# Altium project MSM8916_DRAM_PMIC_REF.PrjPcb (part 3 of 4)

## Sheet 15 PM8916_CHARGING GPIO.SchDoc
size 871 x 576 mm
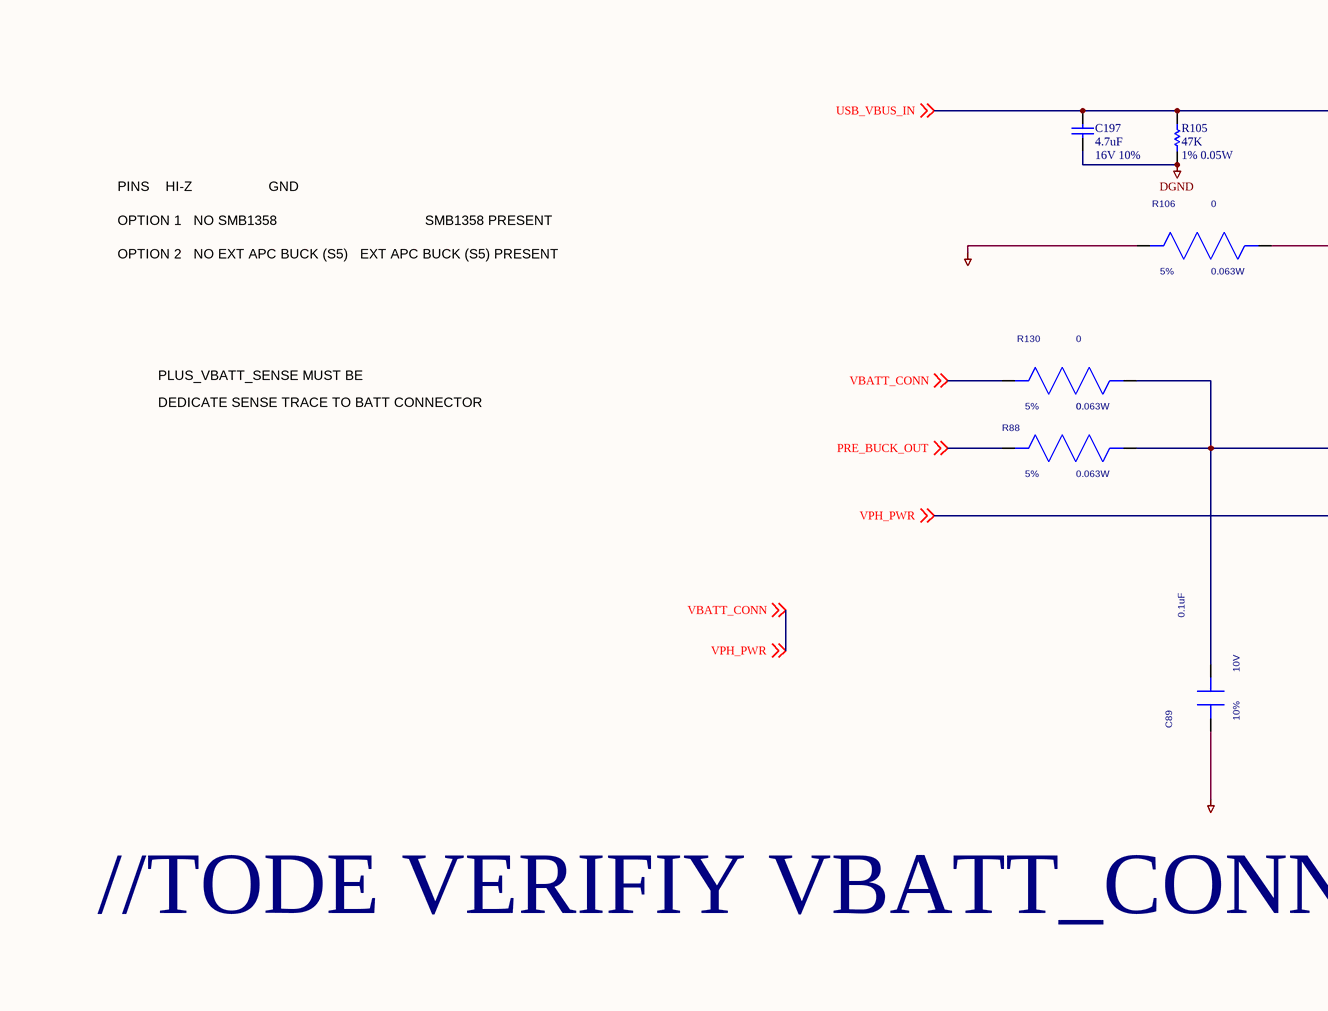
[diagram p39: 15 PM8916_CHARGING GPIO.SchDoc, top left]
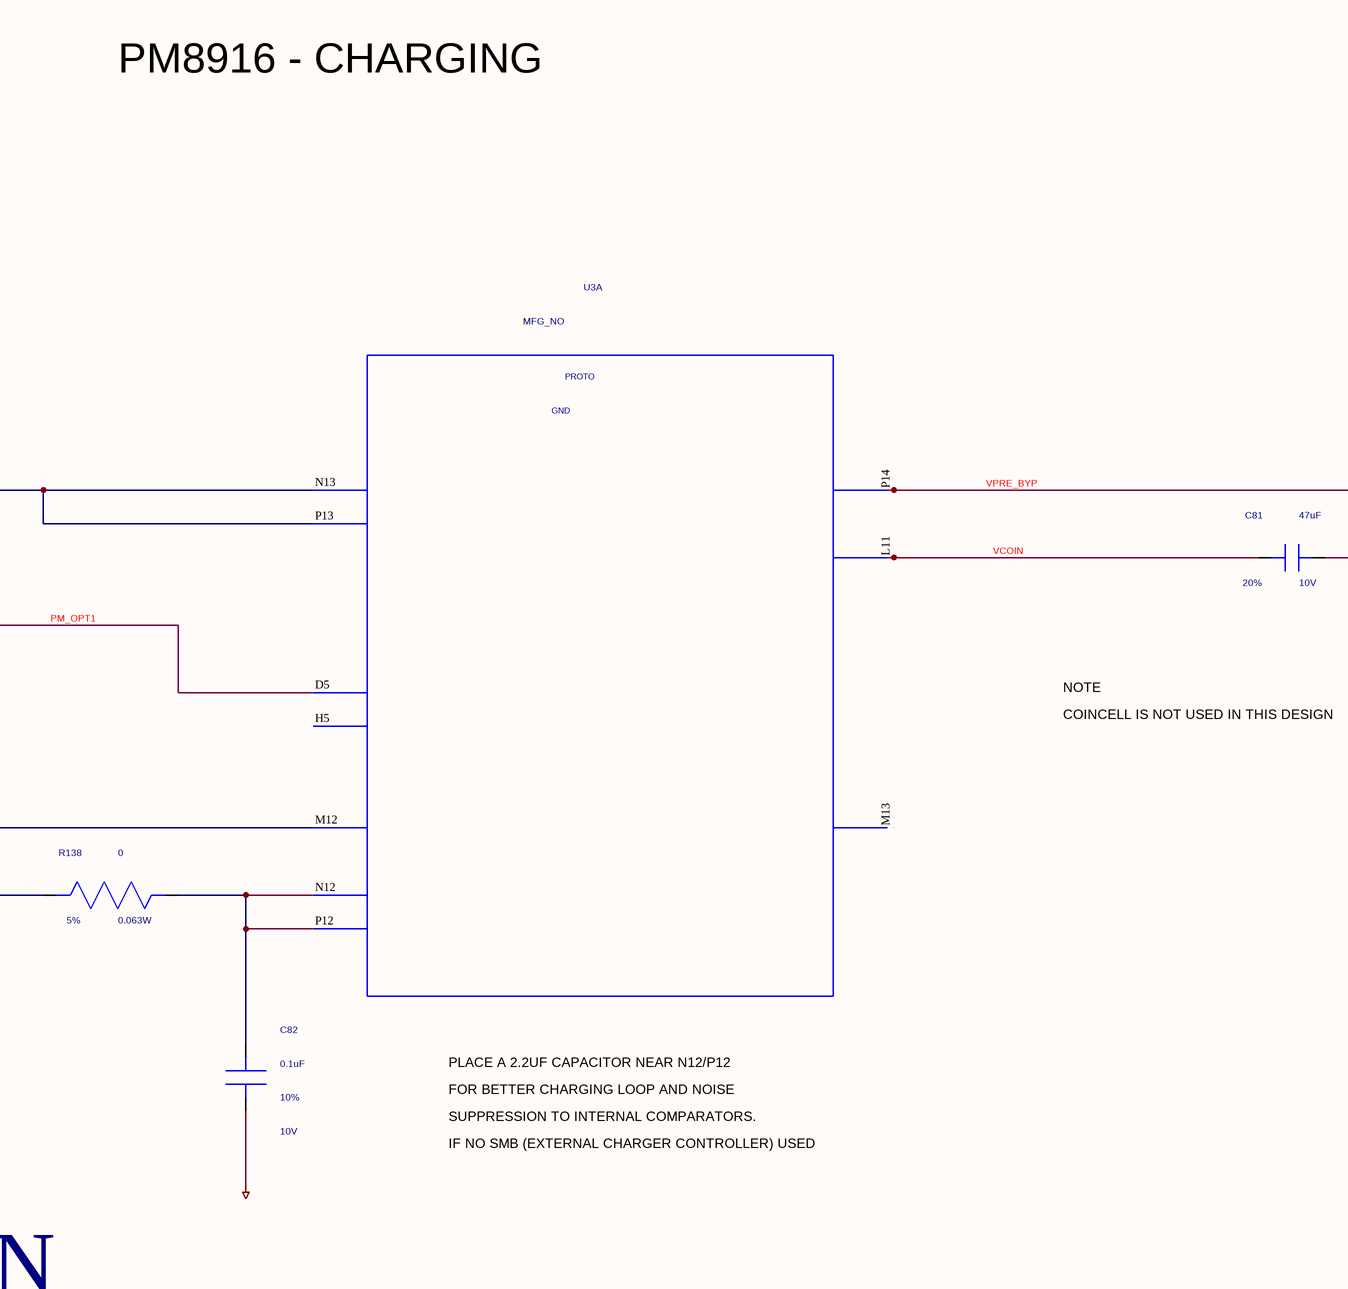
[diagram p40: 15 PM8916_CHARGING GPIO.SchDoc, top middle]
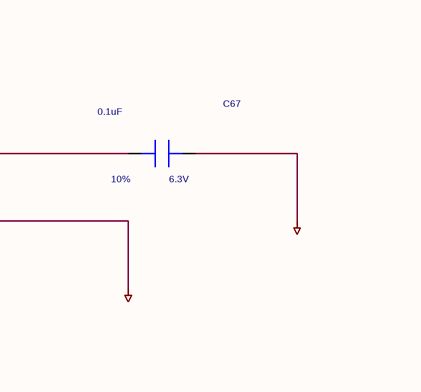
[diagram p41: 15 PM8916_CHARGING GPIO.SchDoc, top right]
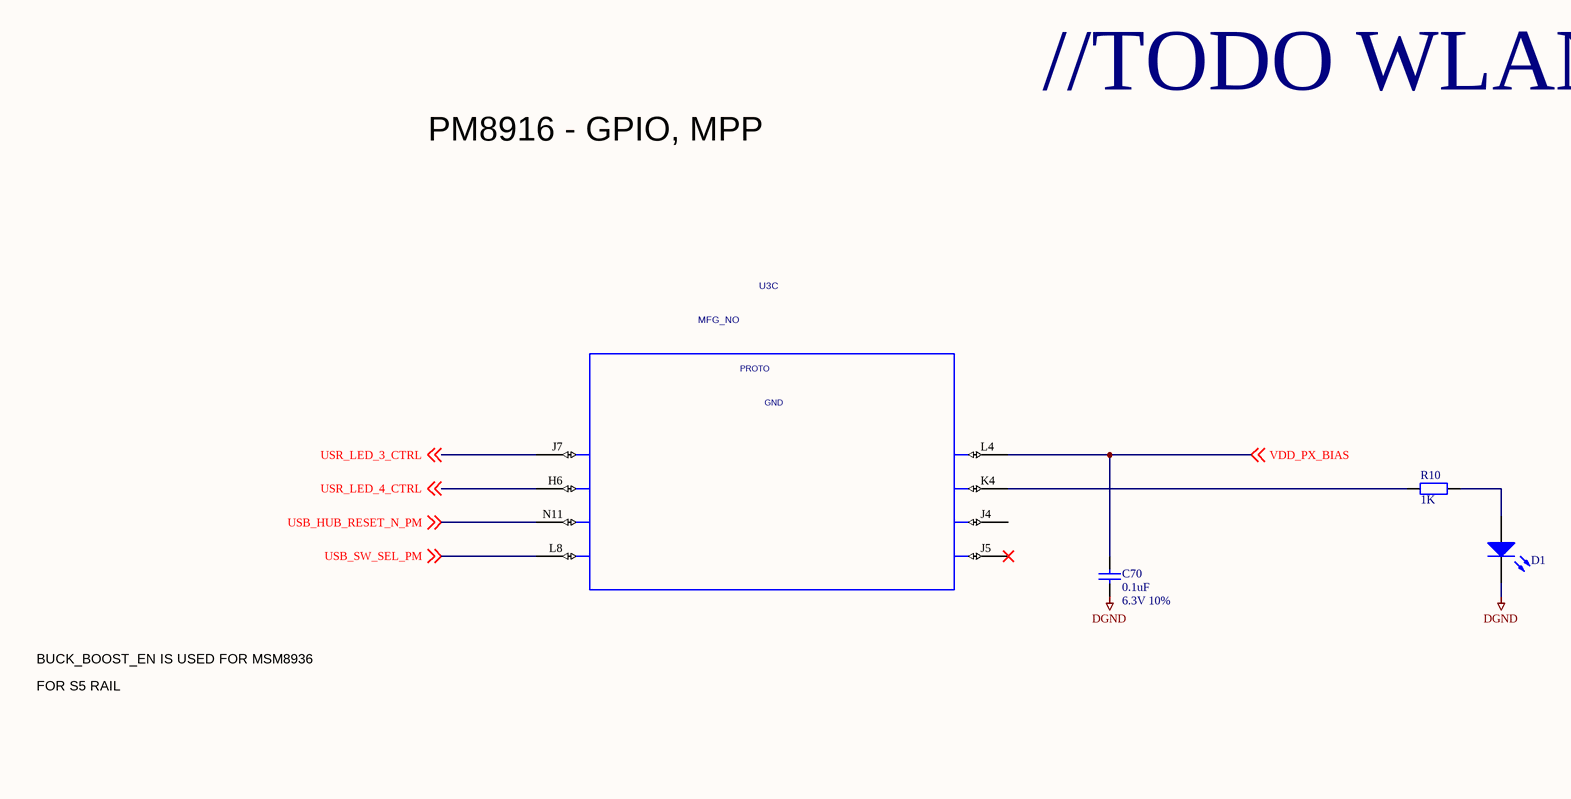
[diagram p42: 15 PM8916_CHARGING GPIO.SchDoc, bottom left]
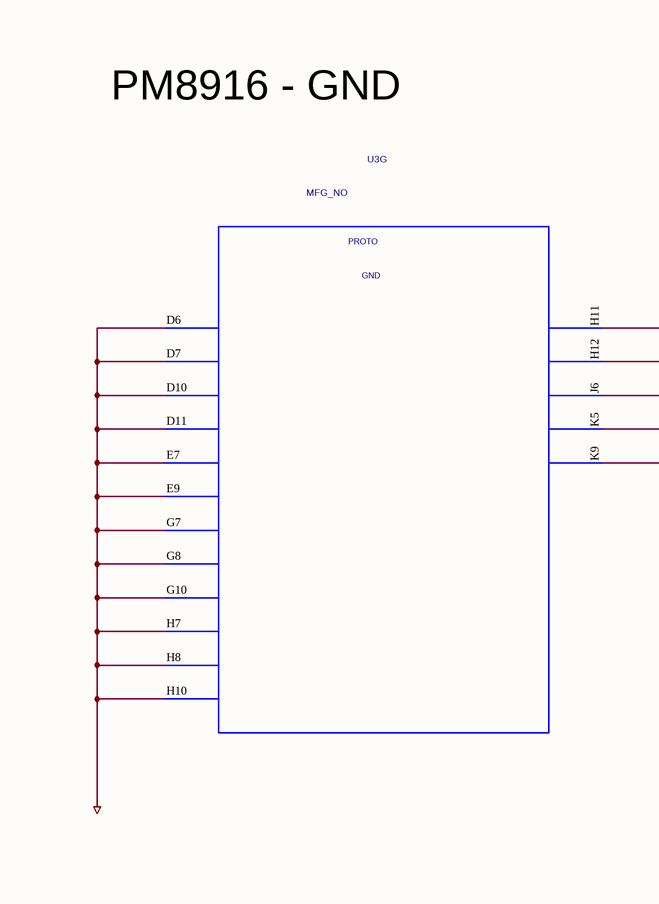
[diagram p43: 15 PM8916_CHARGING GPIO.SchDoc, bottom middle]
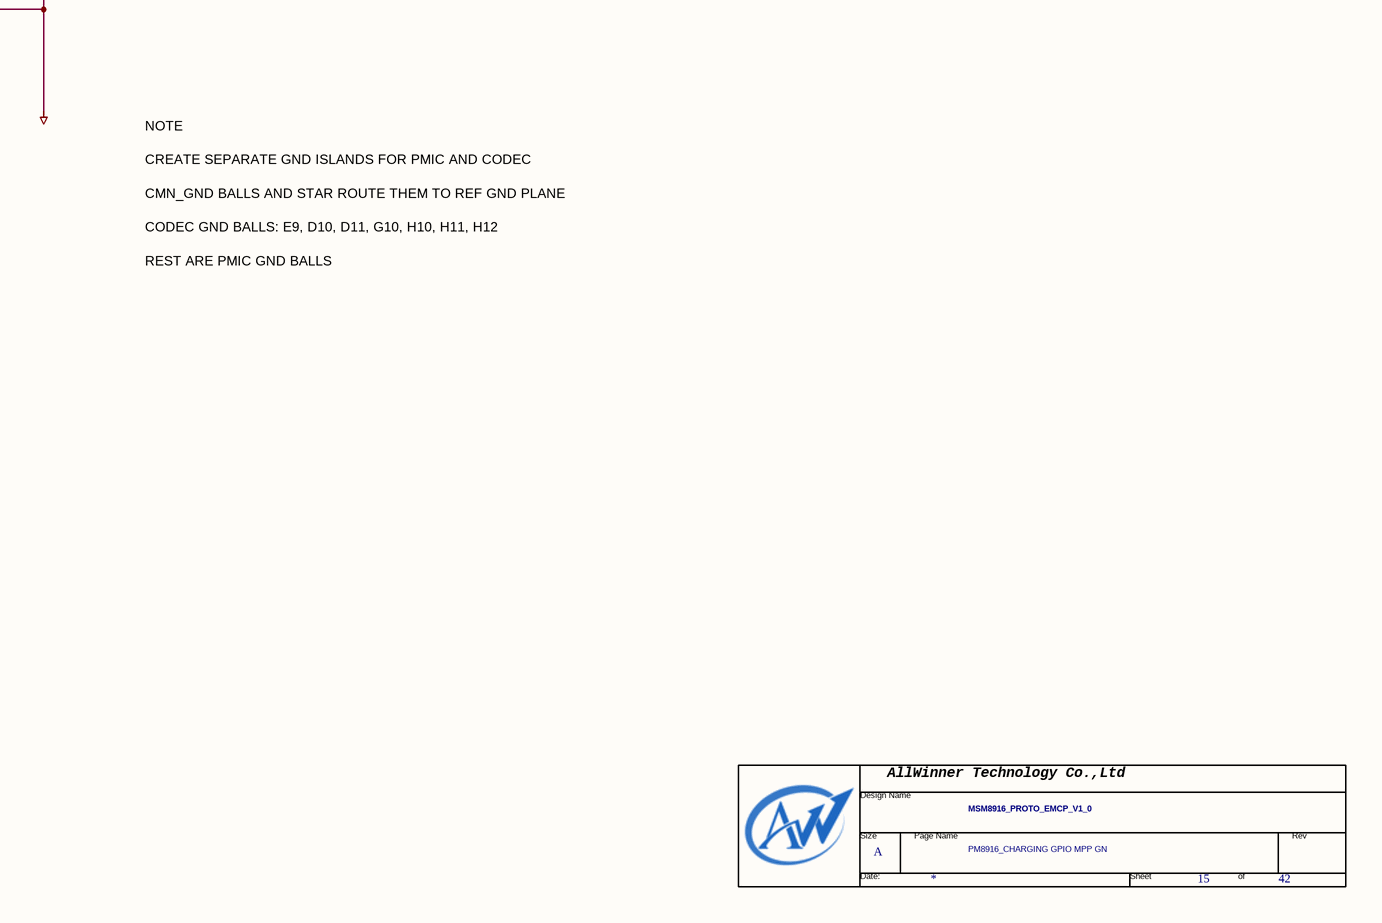
[diagram p44: 15 PM8916_CHARGING GPIO.SchDoc, bottom right]

### Parts
(Parts that share a designator on the sheet are numbered #1, #2 ... from top to bottom, then left to right.)
*#8  Page Count: 42  Page Number: 15  Page Size: A  Title: MSM8916_PROTO_EMCP_V1_0  Doc: PM8916_CHARGING GPIO MPP GN  (hidden comment: TitleBlock0-AW)  (graphical)
C67  0.1uF  VOLT: 10%  Tolerance: 6.3V  [0402C]
C70  0.1uF  value 6.3V 10%  [0402C]
C81  47uF  VOLT: 10V  Tolerance: 20%  [c0402]
C82  0.1uF  VOLT: 10V  Tolerance: 10%  [0402C]
C89  0.1uF  VOLT: 10V  Tolerance: 10%  [0402C]
C197  4.7uF  value 16V 10%  [C0402]
D1  LED0  [LED_0805]  (value not drawn)
R10  value 1K  [r0402]  (hidden comment: Res1)
R88  0  Tolerance: 5%  POWER: 0.063W  [c0402]
R105  47K  value 1% 0.05W  [r0402]
R106  0  Tolerance: 5%  POWER: 0.063W  [c0402]
R130  0  Tolerance: 5%  POWER: 0.063W  [c0402]
R138  0  Tolerance: 5%  POWER: 0.063W  [c0402]
U3  SYMNAME: GND  PART_ID: MFG_NO  BLOCKID: PROTO  [PM-8916-0-176NSP-TR-00-0]  (hidden comment: ASIC_PM8916)  (parts A,C,G of 7)

### Nets
DGND: C67.1(POS) C70.1 C81.2(NEG) C82.2(NEG) C89.1(POS) C197.1 D1.2(K) R105.1 R106.1(POS) U3.D6(CMN_GND_1) U3.D7(CMN_GND_2) U3.D10(CMN_GND_3) U3.D11(CMN_GND_4) U3.E7(CMN_GND_5) U3.E9(CMN_GND_6) U3.G7(CMN_GND_7) U3.G8(CMN_GND_8) U3.G10(CMN_GND_9) U3.H7(CMN_GND_10) U3.H8(CMN_GND_11) U3.H10(CMN_GND_12) U3.H11(CMN_GND_13) U3.H12(CMN_GND_14) U3.J6(CMN_GND_15) U3.K5(CMN_GND_16) U3.K9(CMN_GND_17)
PM_OPT1: R106.2(NEG) U3.D5(OPTION1)
PRE_BUCK_OUT: R88.1(POS) ; off-sheet PRE_BUCK_OUT
USB_HUB_RESET_N_PM: U3.N11(GPIO3) ; off-sheet USB_HUB_RESET_N_PM
USB_SW_SEL_PM: U3.L8(GPIO4) ; off-sheet USB_SW_SEL_PM
USB_VBUS_IN: C197.2 R105.2 U3.N13(USB_IN1) U3.P13(USB_IN2) ; off-sheet USB_VBUS_IN
USR_LED_3_CTRL: U3.J7(GPIO1) ; off-sheet USR_LED_3_CTRL
USR_LED_4_CTRL: U3.H6(GPIO2) ; off-sheet USR_LED_4_CTRL
VBATT_CONN: R130.1(POS) R138.1(POS) ; off-sheet VPH_PWR, off-sheet VBATT_CONN  [also labelled VPH_PWR]
VCOIN: C81.1(POS) U3.L11(VCOIN)
VDD_PX_BIAS: C70.2 U3.L4(MPP1) ; off-sheet VDD_PX_BIAS
VPRE_BYP: C67.2(NEG) U3.P14(VPRE_BYP)
NetC82_1: C82.1(POS) R138.2(NEG) U3.N12(VBAT1) U3.P12(VBAT2)
NetC89_2: C89.2(NEG) R88.2(NEG) R130.2(NEG) U3.M12(VBAT_SNS)
NetD1_1: D1.1(A) R10.2
NetR10_1: R10.1 U3.K4(MPP2)

Not connected (* = marked no-connect by the designer): U3 H5(OPTION2) J4(MPP3) J5(MPP4)* M13(CHG_LED_SINK)

### Notes on the sheet
- PM8916 - CHARGING
- PINS    HI-Z                   GND
- OPTION 1   NO SMB1358                                     SMB1358 PRESENT
- OPTION 2   NO EXT APC BUCK (S5)   EXT APC BUCK (S5) PRESENT
- NOTE
- COINCELL IS NOT USED IN THIS DESIGN
- PLUS_VBATT_SENSE MUST BE
- DEDICATE SENSE TRACE TO BATT CONNECTOR
- PLACE A 2.2UF CAPACITOR NEAR N12/P12
- FOR BETTER CHARGING LOOP AND NOISE
- SUPPRESSION TO INTERNAL COMPARATORS.
- IF NO SMB (EXTERNAL CHARGER CONTROLLER) USED
- //TODE VERIFIY VBATT_CONN
- //TODO WLAN LED HERE
- PM8916 - GND
- PM8916 - GPIO, MPP
- CREATE SEPARATE GND ISLANDS FOR PMIC AND CODEC
- BUCK_BOOST_EN IS USED FOR MSM8936
- CMN_GND BALLS AND STAR ROUTE THEM TO REF GND PLANE
- CODEC GND BALLS: E9, D10, D11, G10, H10, H11, H12
- FOR S5 RAIL
- REST ARE PMIC GND BALLS
- (in symbol TitleBlock0-AW) AllWinner Technology Co.,Ltd; Design Name; Size; Page Name; Rev; Date:; Sheet; of

### Library data of the parts
C67 C81 C89 = CAP#1: PART_NUMBER: MCN_NO; PART_ID: MFG_NO; OriginalSymbolOrigin: (-75,50); SYMNAME: CAP; CDS_LMAN_SYM_OUTLINE: -25,50,25,-50; PACK_TYPE: ?
C70 C197 = Cap: Capacitor; Published: 8-Jun-2000; LatestRevisionDate: 17-Jul-2002; LatestRevisionNote: Re-released for DXP Platform.; PackageReference: RAD-0.3; Publisher: Altium Limited; PackageDescription: Radial Cap, Thru-Hole; 2 Leads; 0.3 in Pin Spacing
C82 = CAP: PART_NUMBER: MCN_NO; PART_ID: MFG_NO; OriginalSymbolOrigin: (-100,75); CDS_LMAN_SYM_OUTLINE: -75,25,75,-25; SYMNAME: CAP; PACK_TYPE: ?
D1 = LED0: 发光二极管; Published: 8-Jun-2000; LatestRevisionDate: 08-Jul-2005; LatestRevisionNote: Mech Layer 1 removed.; PackageReference: LED-0; Publisher: Altium Limited
R10 = Res1: 贴片电阻; Published: 8-Jun-2000; LatestRevisionDate: 17-Jul-2002; LatestRevisionNote: Re-released for DXP Platform.; PackageReference: AXIAL-0.4; Publisher: Altium Limited
R88 R106 R130 R138 = RESISTOR_Dup3: PART_NUMBER: MCN_NO; PART_ID: MFG_NO; OriginalSymbolOrigin: (-200,50); CDS_LMAN_SYM_OUTLINE: -150,50,150,-50; SYMNAME: resistor; PACK_TYPE: ?
R105 = Res1: Resistor; Published: 8-Jun-2000; LatestRevisionDate: 17-Jul-2002; LatestRevisionNote: Re-released for DXP Platform.; PackageReference: AXIAL-0.3; Publisher: Altium Limited; PackageDescription: Axial Device, Thru-Hole; 2 Leads; 0.3 in Pin Spacing
U3 = ASIC_PM8916: PART_NUMBER: MCN_NO; OriginalSymbolOrigin: (-1050,1125); SPLIT_INST: TRUE; CDS_LMAN_SYM_OUTLINE: -850,1125,875,-1250; CDS_LMAN_SPLIT_NUMBER: 1 of 7; PACK_TYPE: ?
*#8 = TitleBlock0-AW: RevCode: ?; Page Create Date: March  8, 1995; Page Modify Date: *

## Sheet 16 PM8916_SMPS.SchDoc
size 868 x 576 mm
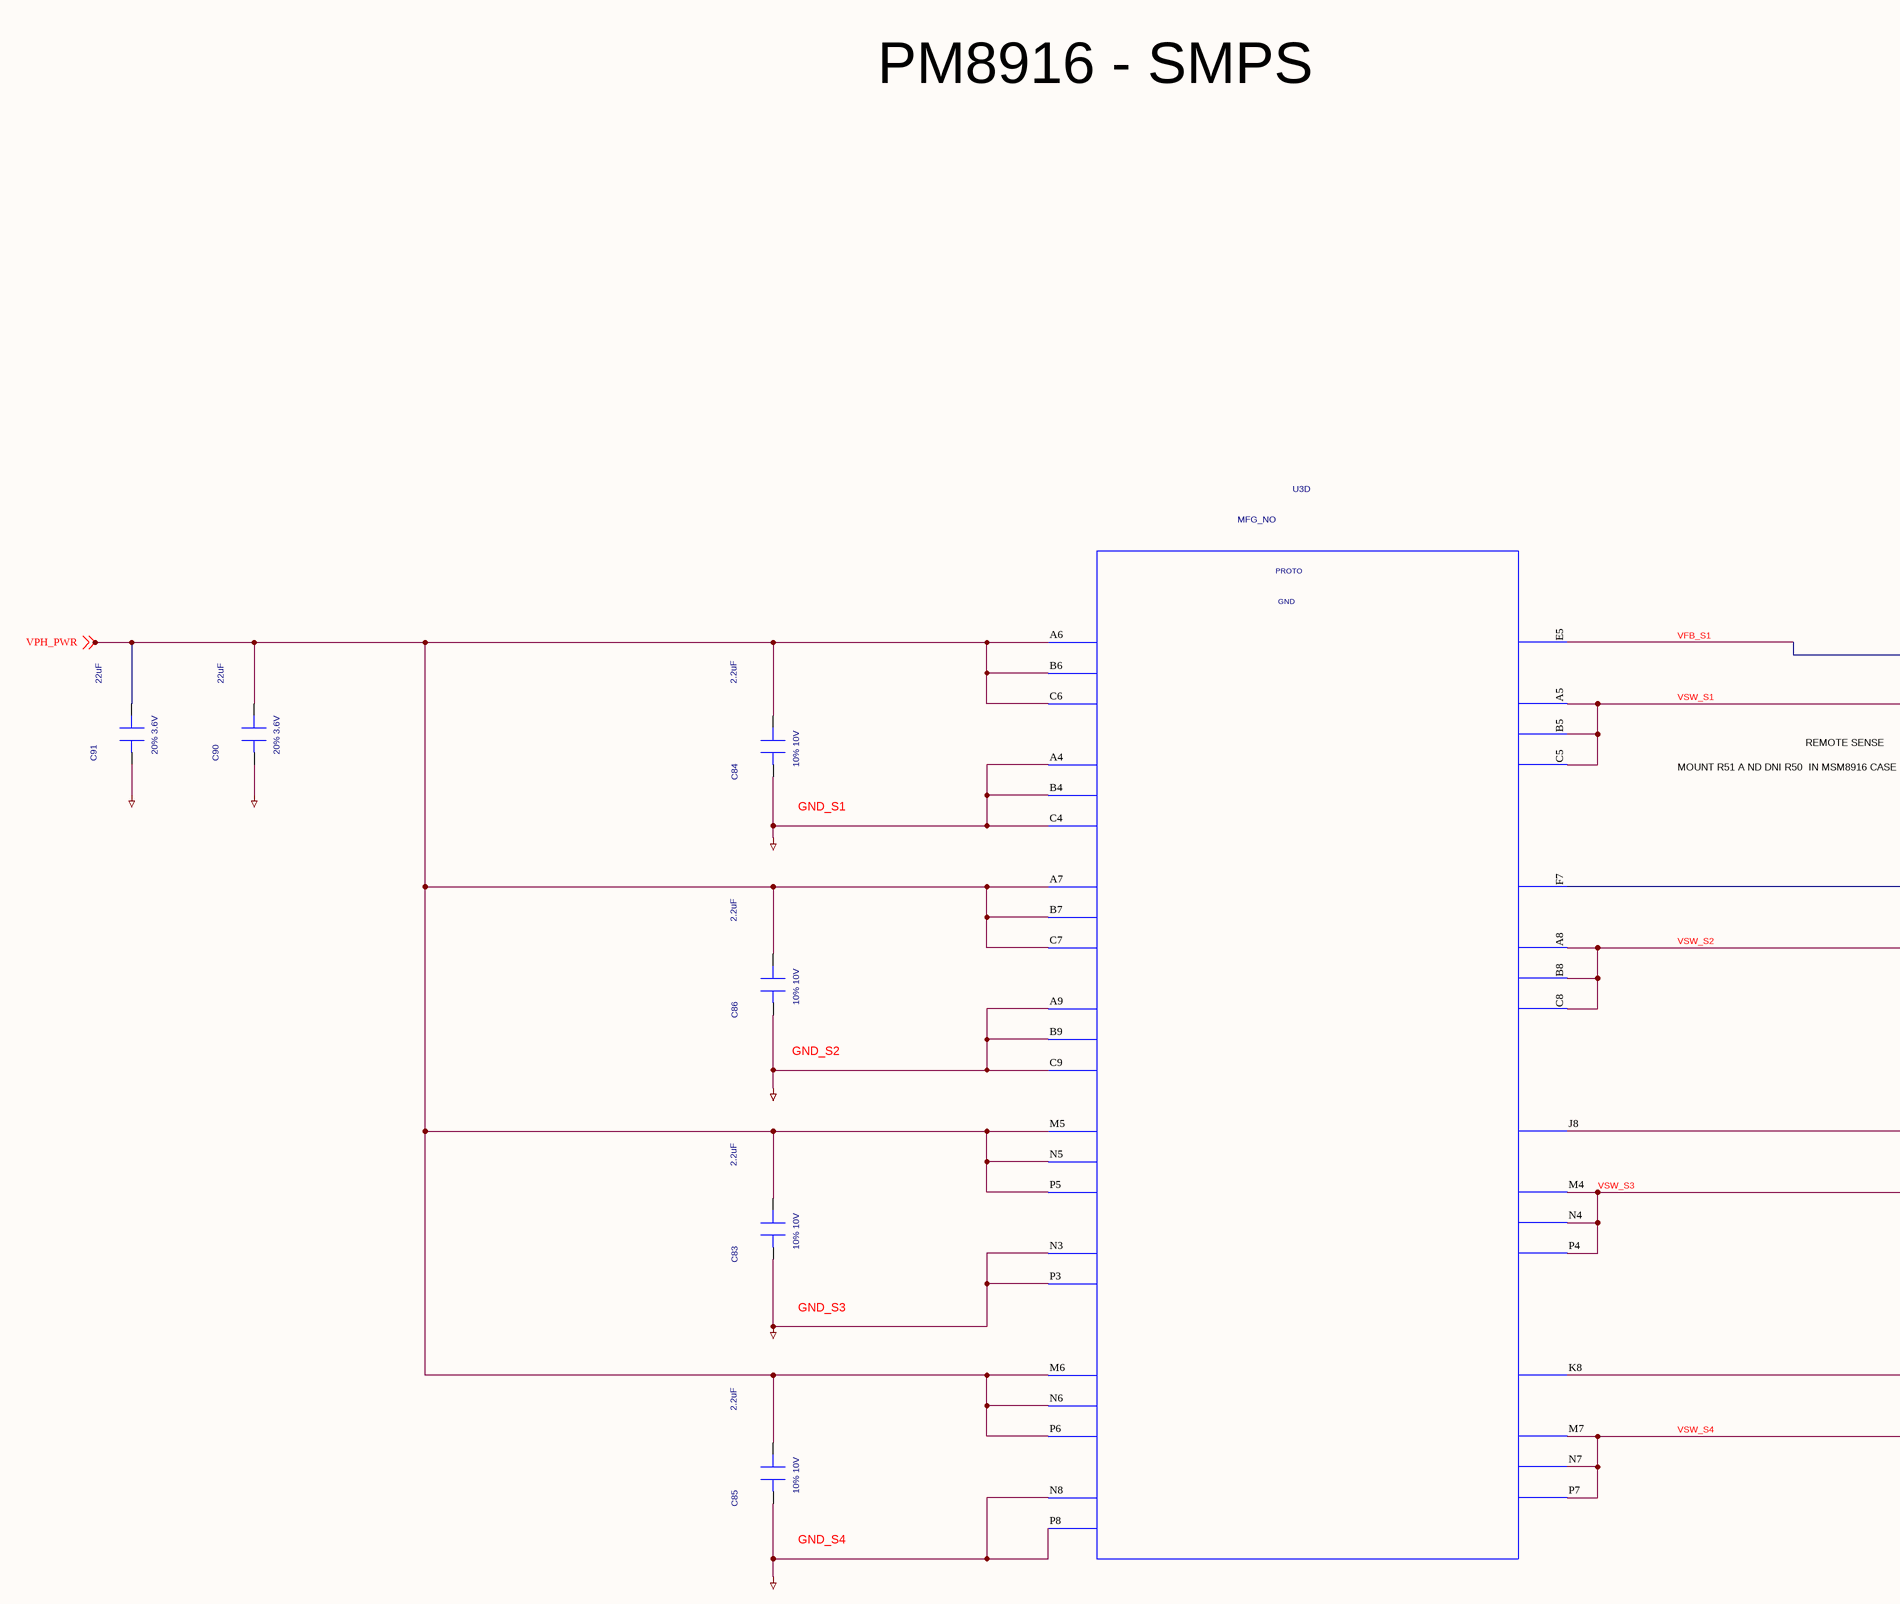
[diagram p45: 16 PM8916_SMPS.SchDoc, top left]
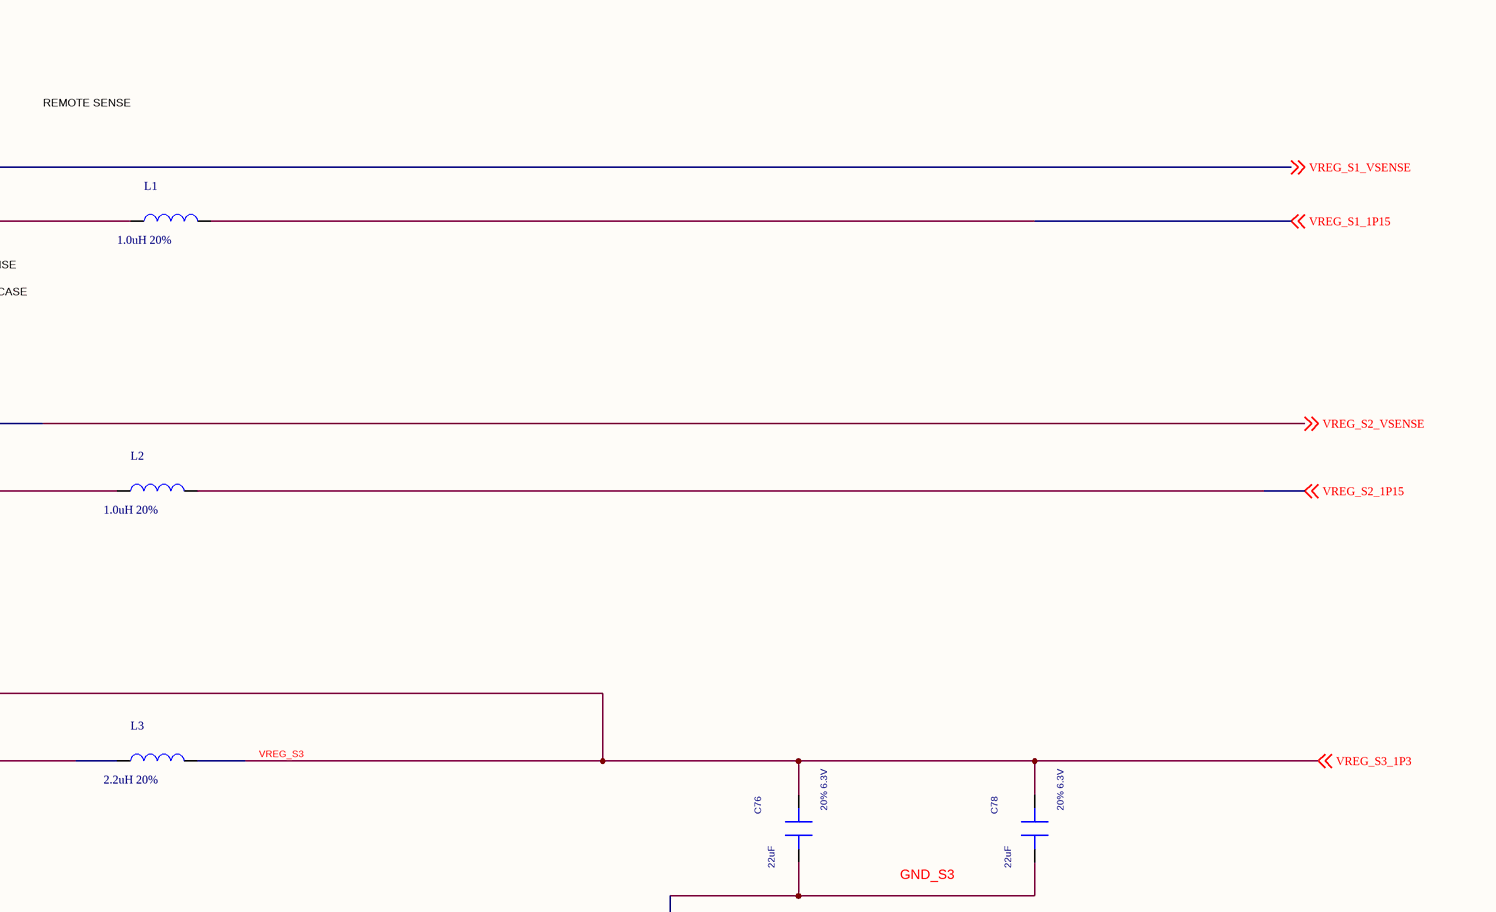
[diagram p46: 16 PM8916_SMPS.SchDoc, top right]
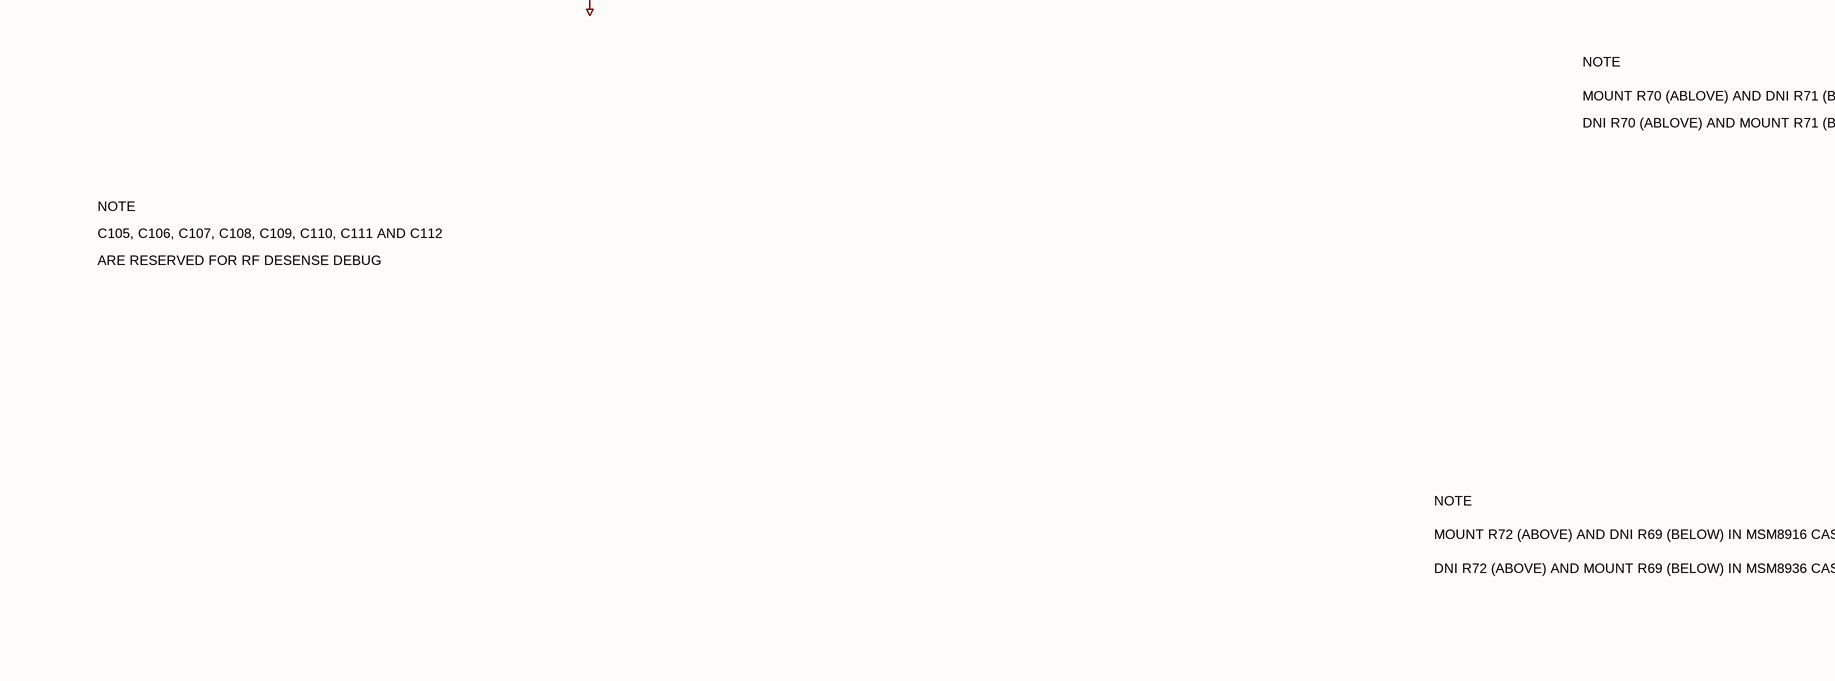
[diagram p47: 16 PM8916_SMPS.SchDoc, bottom left]
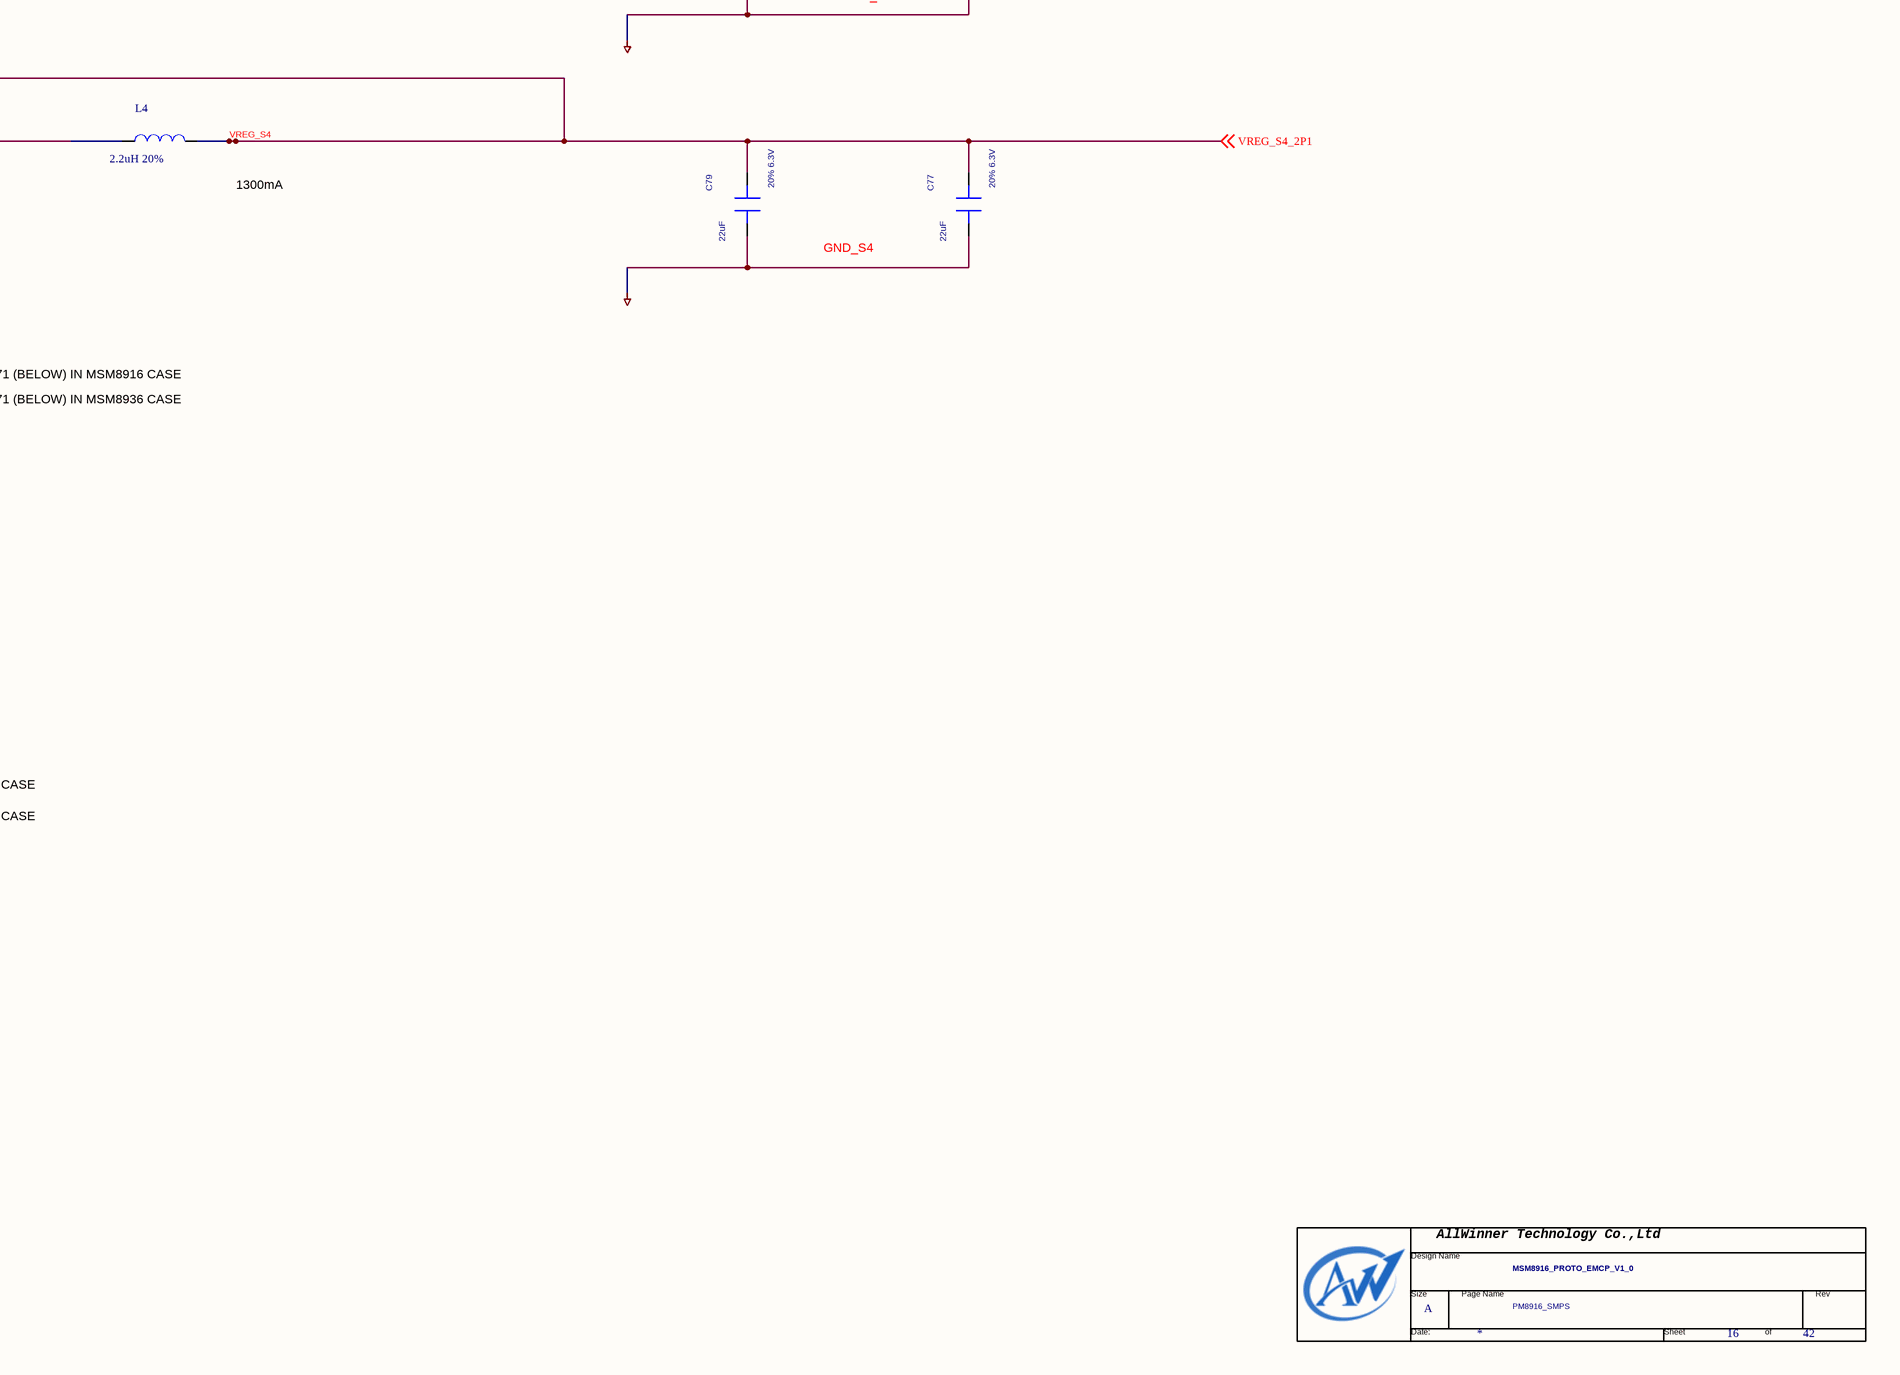
[diagram p48: 16 PM8916_SMPS.SchDoc, bottom right]

### Parts
(Parts that share a designator on the sheet are numbered #1, #2 ... from top to bottom, then left to right.)
*#9  Page Count: 42  Page Number: 16  Page Size: A  Title: MSM8916_PROTO_EMCP_V1_0  Doc: PM8916_SMPS  (hidden comment: TitleBlock0-AW)  (graphical)
C76  22uF  Tolerance: 20% 6.3V  [c0402]
C77  22uF  Tolerance: 20% 6.3V  [c0402]
C78  22uF  Tolerance: 20% 6.3V  [c0402]
C79  22uF  Tolerance: 20% 6.3V  [c0402]
C83  2.2uF  Tolerance: 10% 10V  [c0402]
C84  2.2uF  Tolerance: 10% 10V  [c0402]
C85  2.2uF  Tolerance: 10% 10V  [c0402]
C86  2.2uF  Tolerance: 10% 10V  [c0402]
C90  22uF  Tolerance: 20% 3.6V  [c0402]
C91  22uF  Tolerance: 20% 3.6V  [c0402]
L1  1.0uH 20%  [c0402]
L2  1.0uH 20%  [c0402]
L3  2.2uH 20%  [c0402]
L4  2.2uH 20%  [c0402]
U3  SYMNAME: GND  PART_ID: MFG_NO  BLOCKID: PROTO  [PM-8916-0-176NSP-TR-00-0]  (hidden comment: ASIC_PM8916)  (part D of 7)

### Nets
DGND: C76.1(POS) C77.1(POS) C78.1(POS) C79.1(POS) C83.1(POS) C84.1(POS) C85.1(POS) C86.1(POS) C90.1(POS) C91.1(POS) U3.A4(GND_S1_1) U3.A9(GND_S2_1) U3.B4(GND_S1_2) U3.B9(GND_S2_2) U3.C4(GND_S1_3) U3.C9(GND_S2_3) U3.N3(GND_S3_1) U3.N8(GND_S4_1) U3.P3(GND_S3_2) U3.P8(GND_S4_2)
VFB_S1: U3.E5(VFB_S1) ; off-sheet VREG_S1_VSENSE  [also labelled VREG_S1_VSENSE]
VPH_PWR: C83.2(NEG) C84.2(NEG) C85.2(NEG) C86.2(NEG) C90.2(NEG) C91.2(NEG) U3.A6(VIN_S1_1) U3.A7(VIN_S2_1) U3.B6(VIN_S1_2) U3.B7(VIN_S2_2) U3.C6(VIN_S1_3) U3.C7(VIN_S2_3) U3.M5(VIN_S3_1) U3.M6(VIN_S4_1) U3.N5(VIN_S3_2) U3.N6(VIN_S4_2) U3.P5(VIN_S3_3) U3.P6(VIN_S4_3) ; off-sheet VPH_PWR  [project net VBATT_CONN]
VREG_S1_1P15: L1.2 ; off-sheet VREG_S1_1P15
VREG_S2_1P15: L2.2 ; off-sheet VREG_S2_1P15
VREG_S2_VSENSE: U3.F7(VFB_S2) ; off-sheet VREG_S2_VSENSE
VREG_S3: C76.2(NEG) C78.2(NEG) L3.2 U3.J8(VFB_S3) ; off-sheet VREG_S3_1P3  [also labelled VREG_S3_1P3]
VREG_S4: C77.2(NEG) C79.2(NEG) L4.2 U3.K8(VFB_S4) ; off-sheet VREG_S4_2P1  [also labelled VREG_S4_2P1]
VSW_S1: L1.1 U3.A5(VSW_S1_1) U3.B5(VSW_S1_2) U3.C5(VSW_S1_3)
VSW_S2: L2.1 U3.A8(VSW_S2_1) U3.B8(VSW_S2_2) U3.C8(VSW_S2_3)
VSW_S3: L3.1 U3.M4(VSW_S3_1) U3.N4(VSW_S3_2) U3.P4(VSW_S3_3)
VSW_S4: L4.1 U3.M7(VSW_S4_1) U3.N7(VSW_S4_2) U3.P7(VSW_S4_3)

### Notes on the sheet
- PM8916 - SMPS
- REMOTE SENSE
- MOUNT R51 A ND DNI R50  IN MSM8916 CASE
- (near C84) GND_S1
- (near C86) GND_S2
- GND_S3
- 1300mA
- GND_S4
- NOTE
- DNI R70 (ABLOVE) AND MOUNT R71 (BELOW) IN MSM8936 CASE
- MOUNT R70 (ABLOVE) AND DNI R71 (BELOW) IN MSM8916 CASE
- ARE RESERVED FOR RF DESENSE DEBUG
- C105, C106, C107, C108, C109, C110, C111 AND C112
- MOUNT R72 (ABOVE) AND DNI R69 (BELOW) IN MSM8916 CASE
- DNI R72 (ABOVE) AND MOUNT R69 (BELOW) IN MSM8936 CASE
- (in symbol TitleBlock0-AW) AllWinner Technology Co.,Ltd; Design Name; Size; Page Name; Rev; Date:; Sheet; of

### Library data of the parts
C76-C79 C83-C86 C90 C91 = CAP#1: PART_NUMBER: MCN_NO; PART_ID: MFG_NO; OriginalSymbolOrigin: (-75,50); VOLT: ?V; SYMNAME: CAP; CDS_LMAN_SYM_OUTLINE: -25,50,25,-50; PACK_TYPE: ?
L1-L4 = INDUCTOR_0
U3 = ASIC_PM8916: as U3 on sheet 15 PM8916_CHARGING GPIO; PACK_TYPE: ?
*#9 = TitleBlock0-AW: RevCode: ?; Page Create Date: March  8, 1995; Page Modify Date: *

## Sheet 17 PM8916_LDO.SchDoc
size 868 x 579 mm
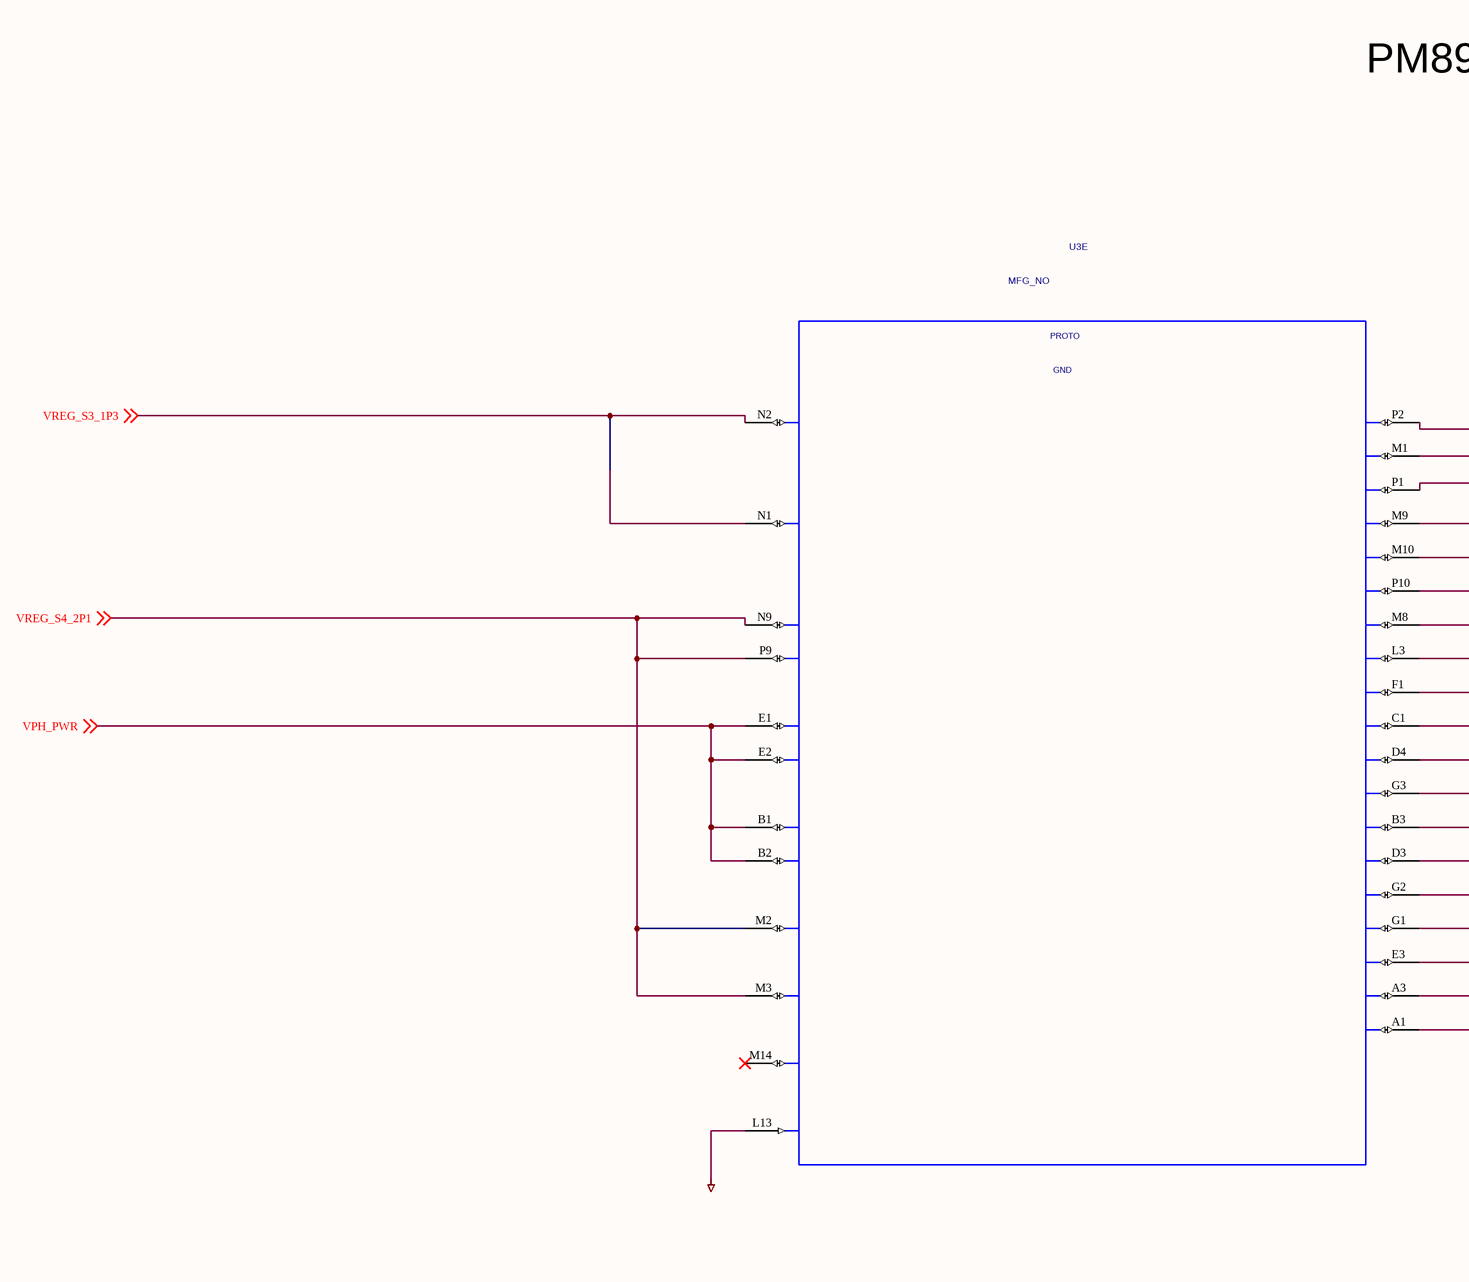
[diagram p49: 17 PM8916_LDO.SchDoc, top left]
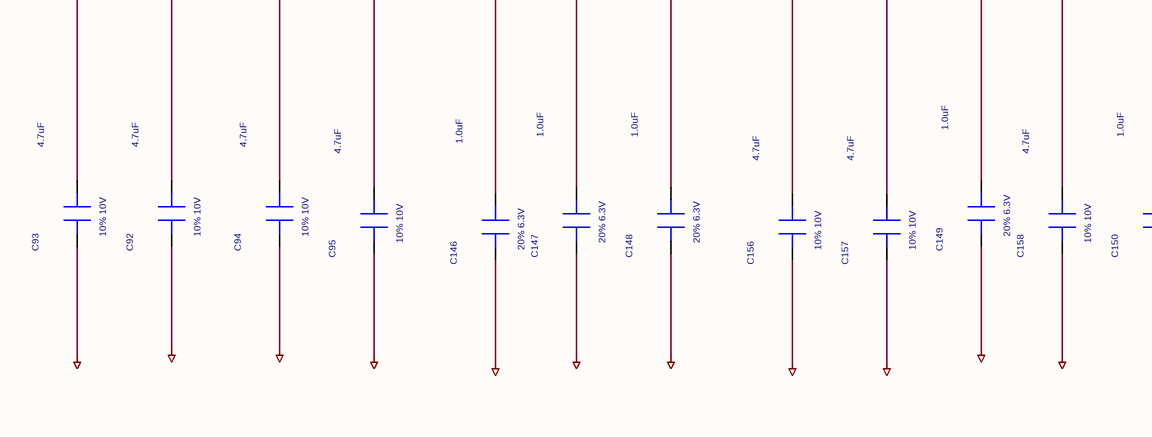
[diagram p50: 17 PM8916_LDO.SchDoc, top middle]
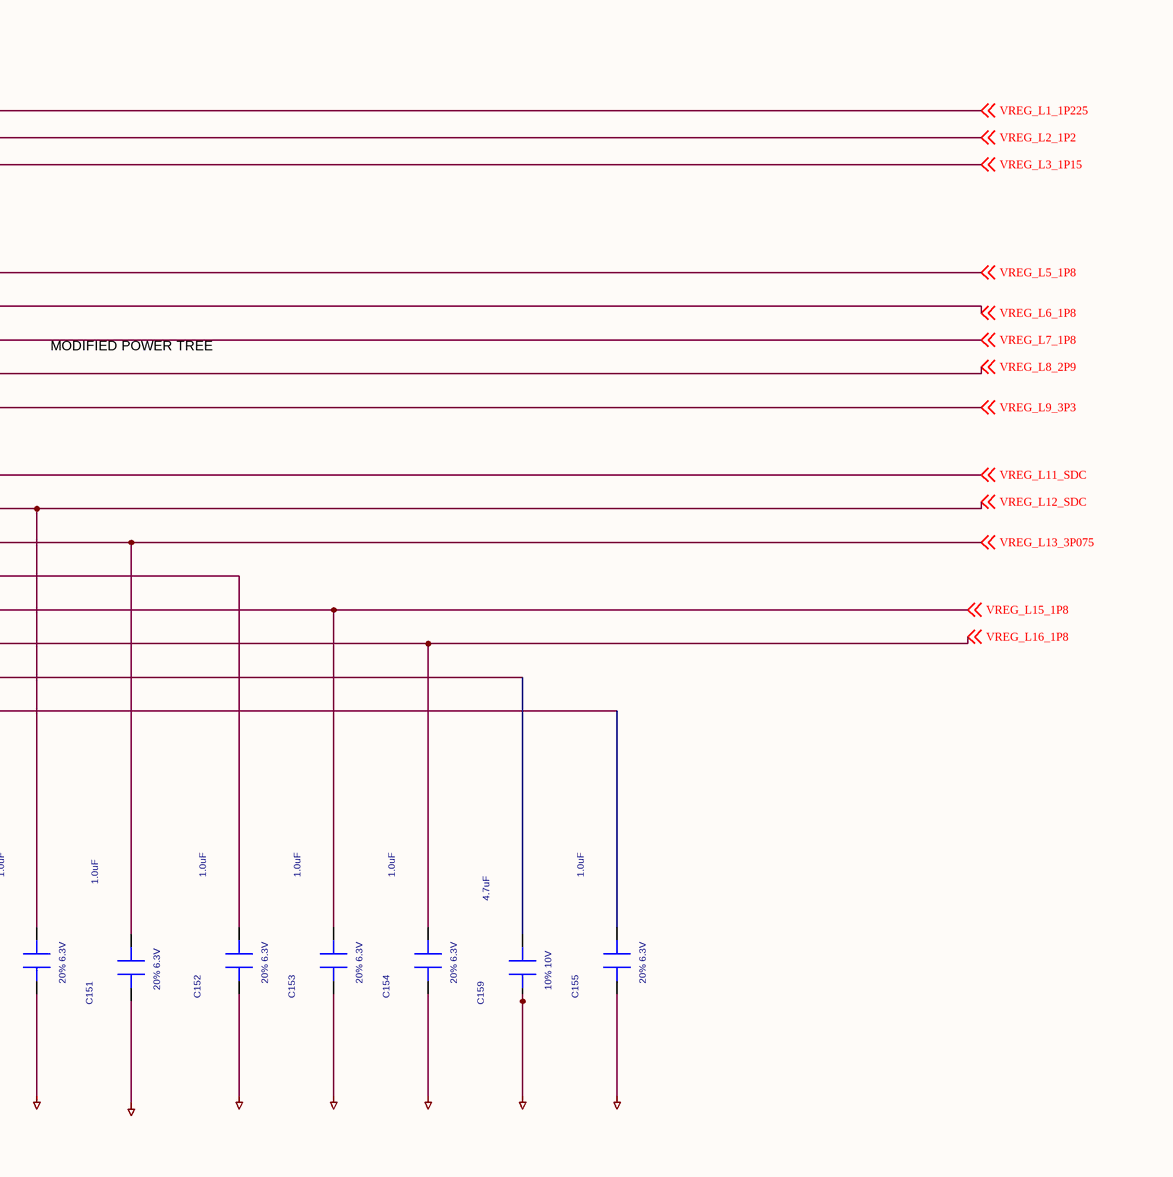
[diagram p51: 17 PM8916_LDO.SchDoc, top right]
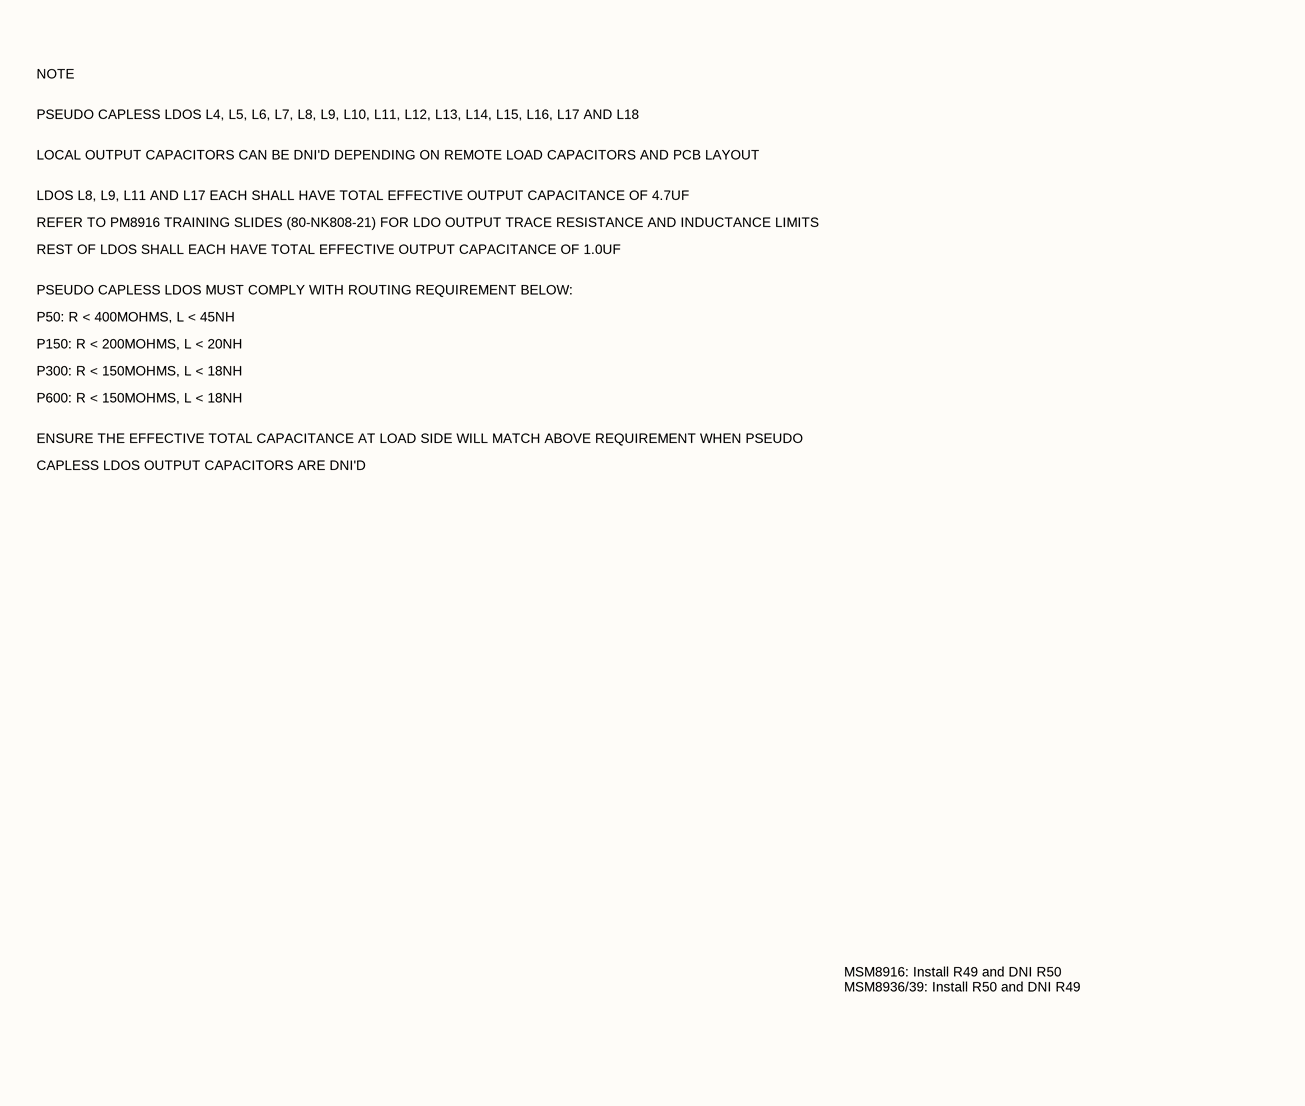
[diagram p52: 17 PM8916_LDO.SchDoc, bottom left]
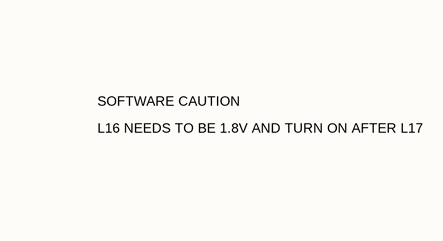
[diagram p53: 17 PM8916_LDO.SchDoc, bottom middle]
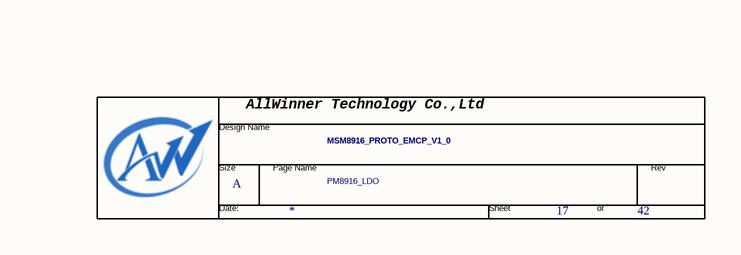
[diagram p54: 17 PM8916_LDO.SchDoc, bottom right]

### Parts
(Parts that share a designator on the sheet are numbered #1, #2 ... from top to bottom, then left to right.)
*#10  Page Count: 42  Page Number: 17  Page Size: A  Title: MSM8916_PROTO_EMCP_V1_0  Doc: PM8916_LDO  (hidden comment: TitleBlock0-AW)  (graphical)
C92  4.7uF  Tolerance: 10% 10V  [c0402]
C93  4.7uF  Tolerance: 10% 10V  [c0402]
C94  4.7uF  Tolerance: 10% 10V  [c0402]
C95  4.7uF  Tolerance: 10% 10V  [c0402]
C146  1.0uF  Tolerance: 20% 6.3V  [c0402]
C147  1.0uF  Tolerance: 20% 6.3V  [c0402]
C148  1.0uF  Tolerance: 20% 6.3V  [c0402]
C149  1.0uF  Tolerance: 20% 6.3V  [c0402]
C150  1.0uF  Tolerance: 20% 6.3V  [c0402]
C151  1.0uF  Tolerance: 20% 6.3V  [c0402]
C152  1.0uF  Tolerance: 20% 6.3V  [c0402]
C153  1.0uF  Tolerance: 20% 6.3V  [c0402]
C154  1.0uF  Tolerance: 20% 6.3V  [c0402]
C155  1.0uF  Tolerance: 20% 6.3V  [c0402]
C156  4.7uF  Tolerance: 10% 10V  [c0402]
C157  4.7uF  Tolerance: 10% 10V  [c0402]
C158  4.7uF  Tolerance: 10% 10V  [c0402]
C159  4.7uF  Tolerance: 10% 10V  [c0402]
U3  SYMNAME: GND  PART_ID: MFG_NO  BLOCKID: PROTO  [PM-8916-0-176NSP-TR-00-0]  (hidden comment: ASIC_PM8916)  (part E of 7)

### Nets
DGND: C92.1(POS) C93.1(POS) C94.1(POS) C95.1(POS) C146.1(POS) C147.1(POS) C148.1(POS) C149.1(POS) C150.1(POS) C151.1(POS) C152.1(POS) C153.1(POS) C154.1(POS) C155.1(POS) C156.1(POS) C157.1(POS) C158.1(POS) C159.1(POS) U3.L13(GND_DRV)
VREG_L2_1P2: C92.2(NEG) U3.M1(VREG_L2) ; off-sheet VREG_L2_1P2
VREG_L5_1P8: C146.2(NEG) U3.P10(VREG_L5) ; off-sheet VREG_L5_1P8
VREG_L6_1P8: C147.2(NEG) U3.M8(VREG_L6) ; off-sheet VREG_L6_1P8
VPH_PWR: U3.B1(VIN_GR5_A) U3.B2(VIN_GR5_B) U3.E1(VIN_GR4_A) U3.E2(VIN_GR4_B) ; off-sheet VPH_PWR  [project net VBATT_CONN]
VREG_L1_1P225: C93.2(NEG) U3.P2(VREG_L1) ; off-sheet VREG_L1_1P225
VREG_L3_1P15: C94.2(NEG) U3.P1(VREG_L3) ; off-sheet VREG_L3_1P15
VREG_L7_1P8: C148.2(NEG) U3.L3(VREG_L7) ; off-sheet VREG_L7_1P8
VREG_L8_2P9: C156.2(NEG) U3.F1(VREG_L8) ; off-sheet VREG_L8_2P9
VREG_L9_3P3: C157.2(NEG) U3.C1(VREG_L9) ; off-sheet VREG_L9_3P3
VREG_L11_SDC: C158.2(NEG) U3.G3(VREG_L11) ; off-sheet VREG_L11_SDC
VREG_L12_SDC: C150.2(NEG) U3.B3(VREG_L12) ; off-sheet VREG_L12_SDC
VREG_L13_3P075: C151.2(NEG) U3.D3(VREG_L13) ; off-sheet VREG_L13_3P075
VREG_L15_1P8: C153.2(NEG) U3.G1(VREG_L15) ; off-sheet VREG_L15_1P8
VREG_L16_1P8: C154.2(NEG) U3.E3(VREG_L16) ; off-sheet VREG_L16_1P8
VREG_S3_1P3: U3.N1(VIN_GR2) U3.N2(VIN_GR1) ; off-sheet VREG_S3_1P3  [project net VREG_S3]
VREG_S4_2P1: U3.M2(VIN_GR6) U3.M3(VIN_GR7) U3.N9(VIN_GR3_A) U3.P9(VIN_GR3_B) ; off-sheet VREG_S4_2P1  [project net VREG_S4]
NetC95_2: C95.2(NEG) U3.M9(VREG_L4_1) U3.M10(VREG_L4_2)
NetC149_2: C149.2(NEG) U3.D4(VREG_L10)
NetC152_2: C152.2(NEG) U3.G2(VREG_L14)
NetC155_2: C155.2(NEG) U3.A1(VREG_L18)
NetC159_2: C159.2(NEG) U3.A3(VREG_L17)

Not connected (* = marked no-connect by the designer): U3 M14(VIB_DRV*)*

### Notes on the sheet
- PM8916 - LDO
- MODIFIED POWER TREE
- NOTE
- PSEUDO CAPLESS LDOS L4, L5, L6, L7, L8, L9, L10, L11, L12, L13, L14, L15, L16, L17 AND L18
- LOCAL OUTPUT CAPACITORS CAN BE DNI'D DEPENDING ON REMOTE LOAD CAPACITORS AND PCB LAYOUT
- LDOS L8, L9, L11 AND L17 EACH SHALL HAVE TOTAL EFFECTIVE OUTPUT CAPACITANCE OF 4.7UF
- SOFTWARE CAUTION
- L16 NEEDS TO BE 1.8V AND TURN ON AFTER L17
- REST OF LDOS SHALL EACH HAVE TOTAL EFFECTIVE OUTPUT CAPACITANCE OF 1.0UF
- REFER TO PM8916 TRAINING SLIDES (80-NK808-21) FOR LDO OUTPUT TRACE RESISTANCE AND INDUCTANCE LIMITS
- PSEUDO CAPLESS LDOS MUST COMPLY WITH ROUTING REQUIREMENT BELOW:
- P50: R < 400MOHMS, L < 45NH
- P150: R < 200MOHMS, L < 20NH
- P300: R < 150MOHMS, L < 18NH
- P600: R < 150MOHMS, L < 18NH
- CAPLESS LDOS OUTPUT CAPACITORS ARE DNI'D
- ENSURE THE EFFECTIVE TOTAL CAPACITANCE AT LOAD SIDE WILL MATCH ABOVE REQUIREMENT WHEN PSEUDO
- MSM8916: Install R49 and DNI R50
  MSM8936/39: Install R50 and DNI R49
- (in symbol TitleBlock0-AW) AllWinner Technology Co.,Ltd; Design Name; Size; Page Name; Rev; Date:; Sheet; of

### Library data of the parts
C92-C95 C146-C159 = CAP#1: as C76-C79 on sheet 16 PM8916_SMPS; PACK_TYPE: ?
U3 = ASIC_PM8916: as U3 on sheet 15 PM8916_CHARGING GPIO; PACK_TYPE: ?
*#10 = TitleBlock0-AW: RevCode: ?; Page Create Date: March  8, 1995; Page Modify Date: *

## Sheet 20 MEMORY_CONTROL.SchDoc
size 871 x 576 mm
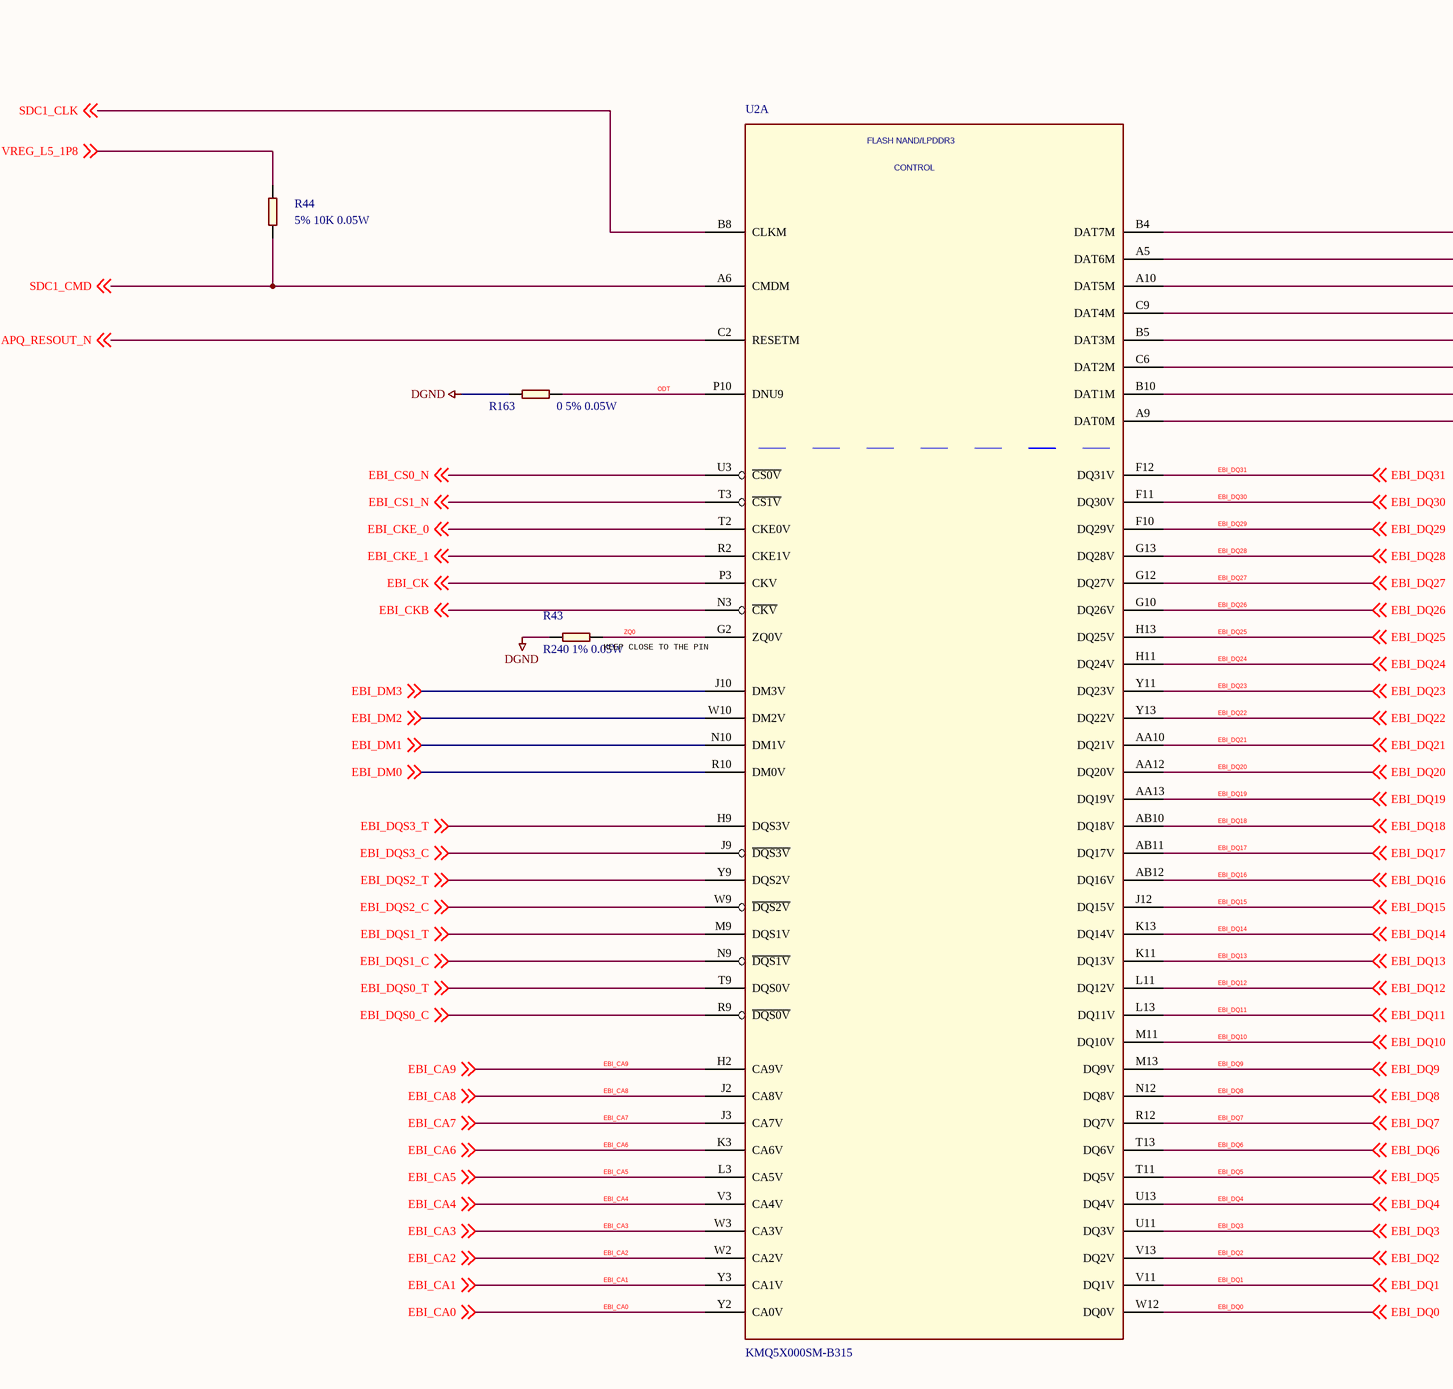
[diagram p55: 20 MEMORY_CONTROL.SchDoc, top left]
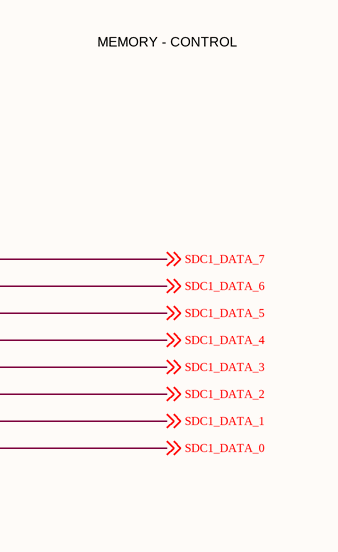
[diagram p56: 20 MEMORY_CONTROL.SchDoc, top middle]
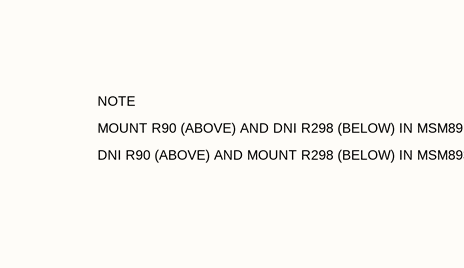
[diagram p57: 20 MEMORY_CONTROL.SchDoc, bottom left]
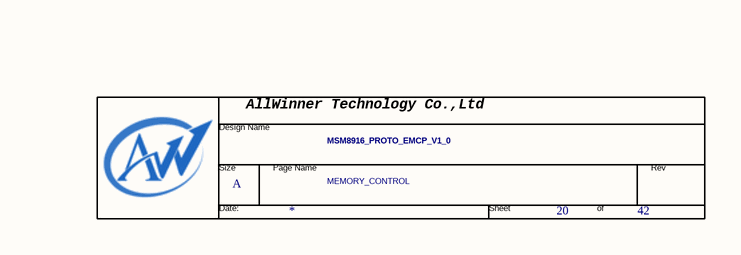
[diagram p58: 20 MEMORY_CONTROL.SchDoc, bottom right]

### Parts
(Parts that share a designator on the sheet are numbered #1, #2 ... from top to bottom, then left to right.)
*#11  Page Count: 42  Page Number: 20  Page Size: A  Title: MSM8916_PROTO_EMCP_V1_0  Doc: MEMORY_CONTROL  (hidden comment: TitleBlock0-AW)  (graphical)
R43  R240 1% 0.05W  [R0201]
R44  5% 10K 0.05W  [R0201]
R163  0 5% 0.05W  [R0201]
U2  KMQ5X000SM-B315  [KMQ5X000SM-B315]  (part A of 3)

### Nets
DGND: R43.1(PIN1) R163.1(PIN1)
VREG_L5_1P8: R44.2(PIN2) ; off-sheet VREG_L5_1P8
APQ_RESOUT_N: U2.C2(RESETM) ; off-sheet APQ_RESOUT_N
EBI_CA0: U2.Y2(CA0V) ; off-sheet EBI_CA0
EBI_CA1: U2.Y3(CA1V) ; off-sheet EBI_CA1
EBI_CA2: U2.W2(CA2V) ; off-sheet EBI_CA2
EBI_CA3: U2.W3(CA3V) ; off-sheet EBI_CA3
EBI_CA4: U2.V3(CA4V) ; off-sheet EBI_CA4
EBI_CA5: U2.L3(CA5V) ; off-sheet EBI_CA5
EBI_CA6: U2.K3(CA6V) ; off-sheet EBI_CA6
EBI_CA7: U2.J3(CA7V) ; off-sheet EBI_CA7
EBI_CA8: U2.J2(CA8V) ; off-sheet EBI_CA8
EBI_CA9: U2.H2(CA9V) ; off-sheet EBI_CA9
EBI_CK: U2.P3(CKV) ; off-sheet EBI_CK
EBI_CKB: U2.N3(~{CKV}) ; off-sheet EBI_CKB
EBI_CKE_0: U2.T2(CKE0V) ; off-sheet EBI_CKE_0
EBI_CKE_1: U2.R2(CKE1V) ; off-sheet EBI_CKE_1
EBI_CS0_N: U2.U3(~{CS0V}) ; off-sheet EBI_CS0_N
EBI_CS1_N: U2.T3(~{CS1V}) ; off-sheet EBI_CS1_N
EBI_DM0: U2.R10(DM0V) ; off-sheet EBI_DM0
EBI_DM1: U2.N10(DM1V) ; off-sheet EBI_DM1
EBI_DM2: U2.W10(DM2V) ; off-sheet EBI_DM2
EBI_DM3: U2.J10(DM3V) ; off-sheet EBI_DM3
EBI_DQ0: U2.W12(DQ0V) ; off-sheet EBI_DQ0
EBI_DQ1: U2.V11(DQ1V) ; off-sheet EBI_DQ1
EBI_DQ2: U2.V13(DQ2V) ; off-sheet EBI_DQ2
EBI_DQ3: U2.U11(DQ3V) ; off-sheet EBI_DQ3
EBI_DQ4: U2.U13(DQ4V) ; off-sheet EBI_DQ4
EBI_DQ5: U2.T11(DQ5V) ; off-sheet EBI_DQ5
EBI_DQ6: U2.T13(DQ6V) ; off-sheet EBI_DQ6
EBI_DQ7: U2.R12(DQ7V) ; off-sheet EBI_DQ7
EBI_DQ8: U2.N12(DQ8V) ; off-sheet EBI_DQ8
EBI_DQ9: U2.M13(DQ9V) ; off-sheet EBI_DQ9
EBI_DQ10: U2.M11(DQ10V) ; off-sheet EBI_DQ10
EBI_DQ11: U2.L13(DQ11V) ; off-sheet EBI_DQ11
EBI_DQ12: U2.L11(DQ12V) ; off-sheet EBI_DQ12
EBI_DQ13: U2.K11(DQ13V) ; off-sheet EBI_DQ13
EBI_DQ14: U2.K13(DQ14V) ; off-sheet EBI_DQ14
EBI_DQ15: U2.J12(DQ15V) ; off-sheet EBI_DQ15
EBI_DQ16: U2.AB12(DQ16V) ; off-sheet EBI_DQ16
EBI_DQ17: U2.AB11(DQ17V) ; off-sheet EBI_DQ17
EBI_DQ18: U2.AB10(DQ18V) ; off-sheet EBI_DQ18
EBI_DQ19: U2.AA13(DQ19V) ; off-sheet EBI_DQ19
EBI_DQ20: U2.AA12(DQ20V) ; off-sheet EBI_DQ20
EBI_DQ21: U2.AA10(DQ21V) ; off-sheet EBI_DQ21
EBI_DQ22: U2.Y13(DQ22V) ; off-sheet EBI_DQ22
EBI_DQ23: U2.Y11(DQ23V) ; off-sheet EBI_DQ23
EBI_DQ24: U2.H11(DQ24V) ; off-sheet EBI_DQ24
EBI_DQ25: U2.H13(DQ25V) ; off-sheet EBI_DQ25
EBI_DQ26: U2.G10(DQ26V) ; off-sheet EBI_DQ26
EBI_DQ27: U2.G12(DQ27V) ; off-sheet EBI_DQ27
EBI_DQ28: U2.G13(DQ28V) ; off-sheet EBI_DQ28
EBI_DQ29: U2.F10(DQ29V) ; off-sheet EBI_DQ29
EBI_DQ30: U2.F11(DQ30V) ; off-sheet EBI_DQ30
EBI_DQ31: U2.F12(DQ31V) ; off-sheet EBI_DQ31
EBI_DQS0_C: U2.R9(~{DQS0V}) ; off-sheet EBI_DQS0_C
EBI_DQS0_T: U2.T9(DQS0V) ; off-sheet EBI_DQS0_T
EBI_DQS1_C: U2.N9(~{DQS1V}) ; off-sheet EBI_DQS1_C
EBI_DQS1_T: U2.M9(DQS1V) ; off-sheet EBI_DQS1_T
EBI_DQS2_C: U2.W9(~{DQS2V}) ; off-sheet EBI_DQS2_C
EBI_DQS2_T: U2.Y9(DQS2V) ; off-sheet EBI_DQS2_T
EBI_DQS3_C: U2.J9(~{DQS3V}) ; off-sheet EBI_DQS3_C
EBI_DQS3_T: U2.H9(DQS3V) ; off-sheet EBI_DQS3_T
ODT: R163.2(PIN2) U2.P10(DNU9)
SDC1_CLK: U2.B8(CLKM) ; off-sheet SDC1_CLK
SDC1_CMD: R44.1(PIN1) U2.A6(CMDM) ; off-sheet SDC1_CMD
SDC1_DATA_0: U2.A9(DAT0M) ; off-sheet SDC1_DATA_0
SDC1_DATA_1: U2.B10(DAT1M) ; off-sheet SDC1_DATA_1
SDC1_DATA_2: U2.C6(DAT2M) ; off-sheet SDC1_DATA_2
SDC1_DATA_3: U2.B5(DAT3M) ; off-sheet SDC1_DATA_3
SDC1_DATA_4: U2.C9(DAT4M) ; off-sheet SDC1_DATA_4
SDC1_DATA_5: U2.A10(DAT5M) ; off-sheet SDC1_DATA_5
SDC1_DATA_6: U2.A5(DAT6M) ; off-sheet SDC1_DATA_6
SDC1_DATA_7: U2.B4(DAT7M) ; off-sheet SDC1_DATA_7
ZQ0: R43.2(PIN2) U2.G2(ZQ0V)

### Notes on the sheet
- MEMORY - CONTROL
- (near R43) KEEP CLOSE TO THE PIN
- NOTE
- MOUNT R90 (ABOVE) AND DNI R298 (BELOW) IN MSM8916 CASE
- DNI R90 (ABOVE) AND MOUNT R298 (BELOW) IN MSM8936 CASE
- (in symbol KMQ5X000SM-B315, part A) FLASH NAND/LPDDR3; CONTROL
- (in symbol TitleBlock0-AW) AllWinner Technology Co.,Ltd; Design Name; Size; Page Name; Rev; Date:; Sheet; of

### Library data of the parts
R43 R44 R163 = R0201
*#11 = TitleBlock0-AW: RevCode: ?; Page Create Date: March  8, 1995; Page Modify Date: *

## Sheet BYPASS_CAP.SchDoc
size A0
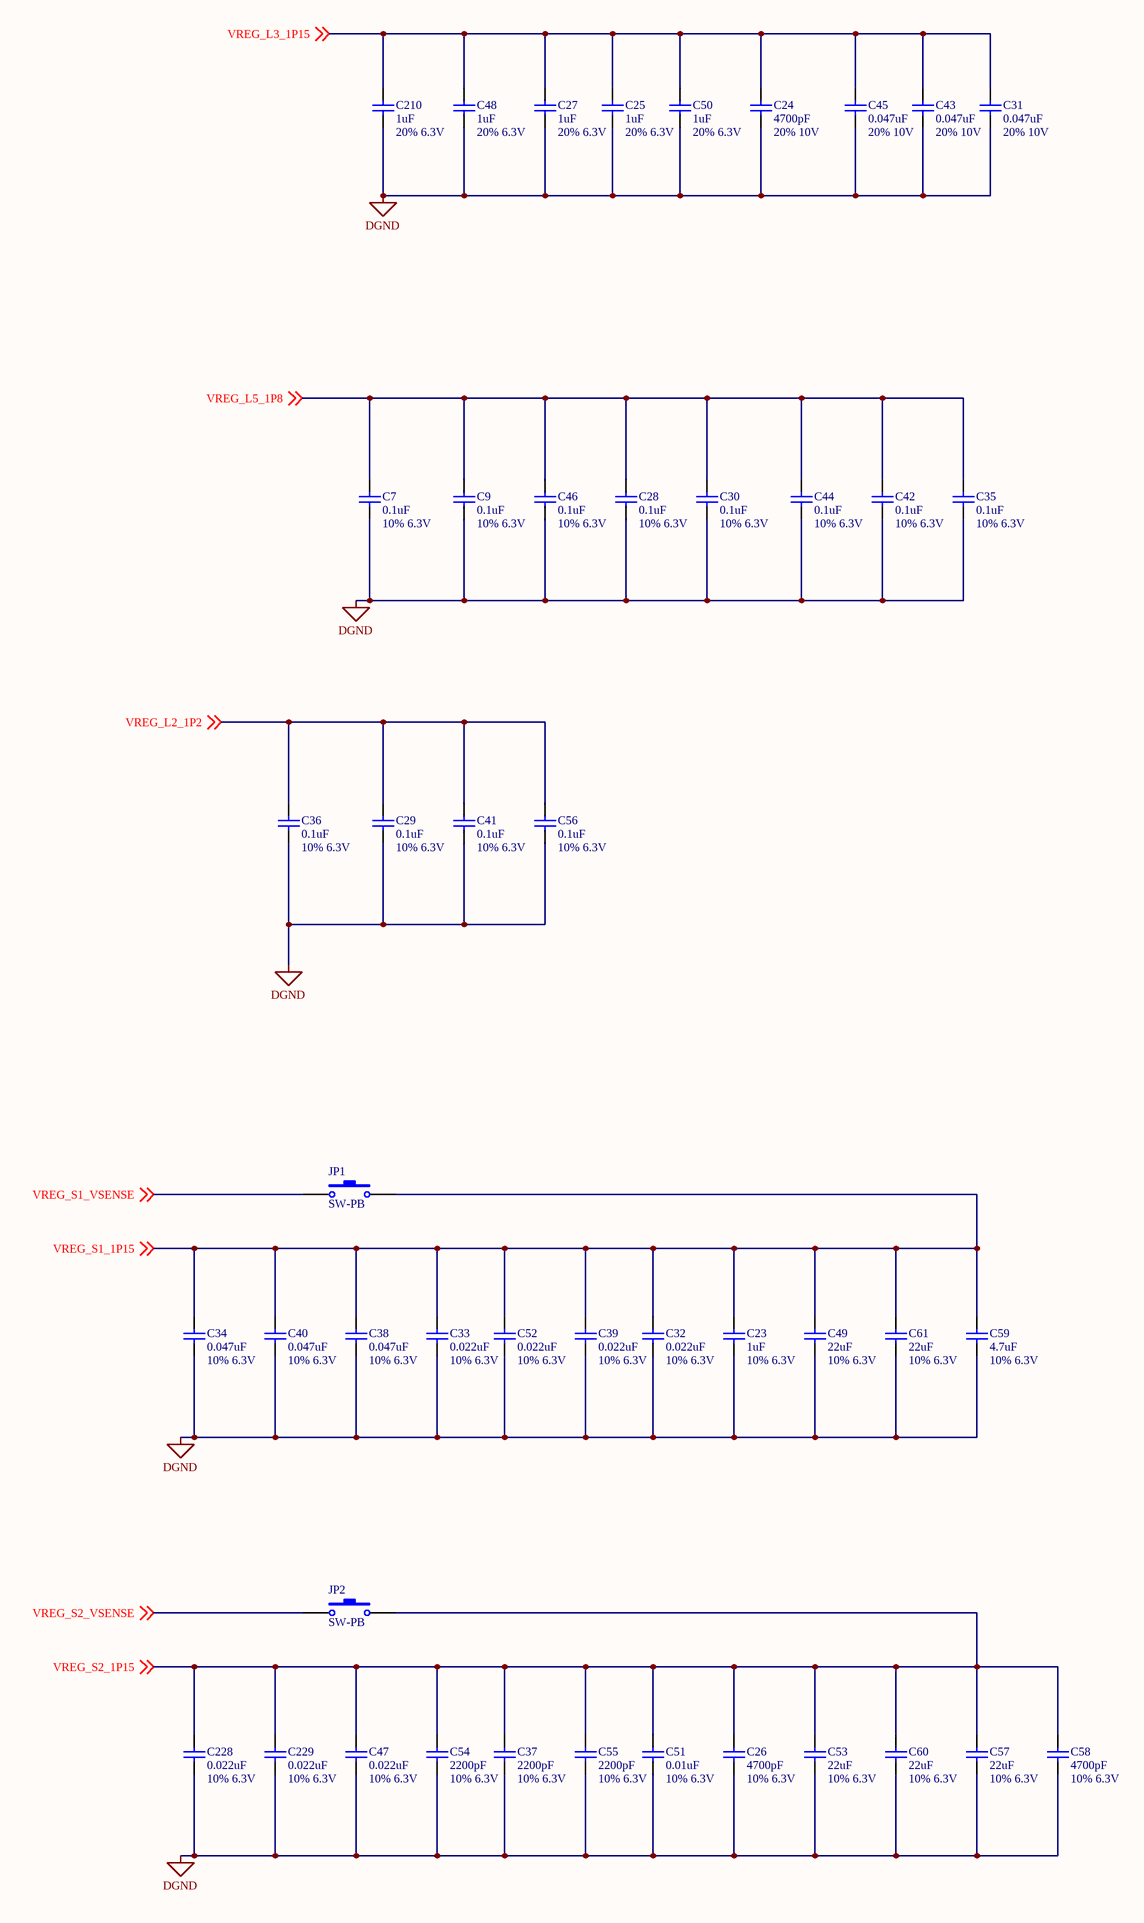
[diagram p59: BYPASS_CAP.SchDoc]

### Parts
C7  0.1uF  value 10% 6.3V  [C0402]
C9  0.1uF  value 10% 6.3V  [C0402]
C23  1uF  value 10% 6.3V  [C0402]
C24  4700pF  value 20% 10V  [C0402]
C25  1uF  value 20% 6.3V  [C0402]
C26  4700pF  value 10% 6.3V  [C0402]
C27  1uF  value 20% 6.3V  [C0402]
C28  0.1uF  value 10% 6.3V  [C0402]
C29  0.1uF  value 10% 6.3V  [C0402]
C30  0.1uF  value 10% 6.3V  [C0402]
C31  0.047uF  value 20% 10V  [C0402]
C32  0.022uF  value 10% 6.3V  [C0402]
C33  0.022uF  value 10% 6.3V  [C0402]
C34  0.047uF  value 10% 6.3V  [C0402]
C35  0.1uF  value 10% 6.3V  [C0402]
C36  0.1uF  value 10% 6.3V  [C0402]
C37  2200pF  value 10% 6.3V  [C0402]
C38  0.047uF  value 10% 6.3V  [C0402]
C39  0.022uF  value 10% 6.3V  [C0402]
C40  0.047uF  value 10% 6.3V  [C0402]
C41  0.1uF  value 10% 6.3V  [C0402]
C42  0.1uF  value 10% 6.3V  [C0402]
C43  0.047uF  value 20% 10V  [C0402]
C44  0.1uF  value 10% 6.3V  [C0402]
C45  0.047uF  value 20% 10V  [C0402]
C46  0.1uF  value 10% 6.3V  [C0402]
C47  0.022uF  value 10% 6.3V  [C0402]
C48  1uF  value 20% 6.3V  [C0402]
C49  22uF  value 10% 6.3V  [C0402]
C50  1uF  value 20% 6.3V  [C0402]
C51  0.01uF  value 10% 6.3V  [C0402]
C52  0.022uF  value 10% 6.3V  [C0402]
C53  22uF  value 10% 6.3V  [C0402]
C54  2200pF  value 10% 6.3V  [C0402]
C55  2200pF  value 10% 6.3V  [C0402]
C56  0.1uF  value 10% 6.3V  [C0402]
C57  22uF  value 10% 6.3V  [C0402]
C58  4700pF  value 10% 6.3V  [C0402]
C59  4.7uF  value 10% 6.3V  [C0402]
C60  22uF  value 10% 6.3V  [C0402]
C61  22uF  value 10% 6.3V  [C0402]
C210  1uF  value 20% 6.3V  [C0402]
C228  0.022uF  value 10% 6.3V  [C0402]
C229  0.022uF  value 10% 6.3V  [C0402]
JP1  SW-PB  [SPST-2]
JP2  SW-PB  [SPST-2]

### Nets
DGND: C7.1 C9.1 C23.1 C24.1 C25.1 C26.1 C27.1 C28.1 C29.1 C30.1 C31.1 C32.1 C33.1 C34.1 C35.1 C36.1 C37.1 C38.1 C39.1 C40.1 C41.1 C42.1 C43.1 C44.1 C45.1 C46.1 C47.1 C48.1 C49.1 C50.1 C51.1 C52.1 C53.1 C54.1 C55.1 C56.1 C57.1 C58.1 C59.1 C60.1 C61.1 C210.1 C228.1 C229.1
VREG_L2_1P2: C29.2 C36.2 C41.2 C56.2 ; off-sheet VREG_L2_1P2
VREG_L5_1P8: C7.2 C9.2 C28.2 C30.2 C35.2 C42.2 C44.2 C46.2 ; off-sheet VREG_L5_1P8
VREG_L3_1P15: C24.2 C25.2 C27.2 C31.2 C43.2 C45.2 C48.2 C50.2 C210.2 ; off-sheet VREG_L3_1P15
VREG_S1_1P15: C23.2 C32.2 C33.2 C34.2 C38.2 C39.2 C40.2 C49.2 C52.2 C59.2 C61.2 JP1.2 ; off-sheet VREG_S1_1P15
VREG_S1_VSENSE: JP1.1 ; off-sheet VREG_S1_VSENSE  [project net VFB_S1]
VREG_S2_1P15: C26.2 C37.2 C47.2 C51.2 C53.2 C54.2 C55.2 C57.2 C58.2 C60.2 C228.2 C229.2 JP2.2 ; off-sheet VREG_S2_1P15
VREG_S2_VSENSE: JP2.1 ; off-sheet VREG_S2_VSENSE

### Library data of the parts
C7 C9 C23-C61 C210 C228 C229 = Cap: Capacitor; Published: 8-Jun-2000; LatestRevisionDate: 17-Jul-2002; LatestRevisionNote: Re-released for DXP Platform.; PackageReference: RAD-0.3; Publisher: Altium Limited; PackageDescription: Radial Cap, Thru-Hole; 2 Leads; 0.3 in Pin Spacing
JP1 JP2 = SW-PB: Switch; Published: 24-Mar-1999; LatestRevisionDate: 17-Jul-2002; LatestRevisionNote: Re-released for DXP Platform.; PackageReference: SPST-2; Publisher: Altium Limited; PackageDescription: Switch; 2 Leads